# EAGLE design Wind_Sensitive_LED_Tree_v1 (EAGLE 9.7.0)

## Sheet 1 of 3
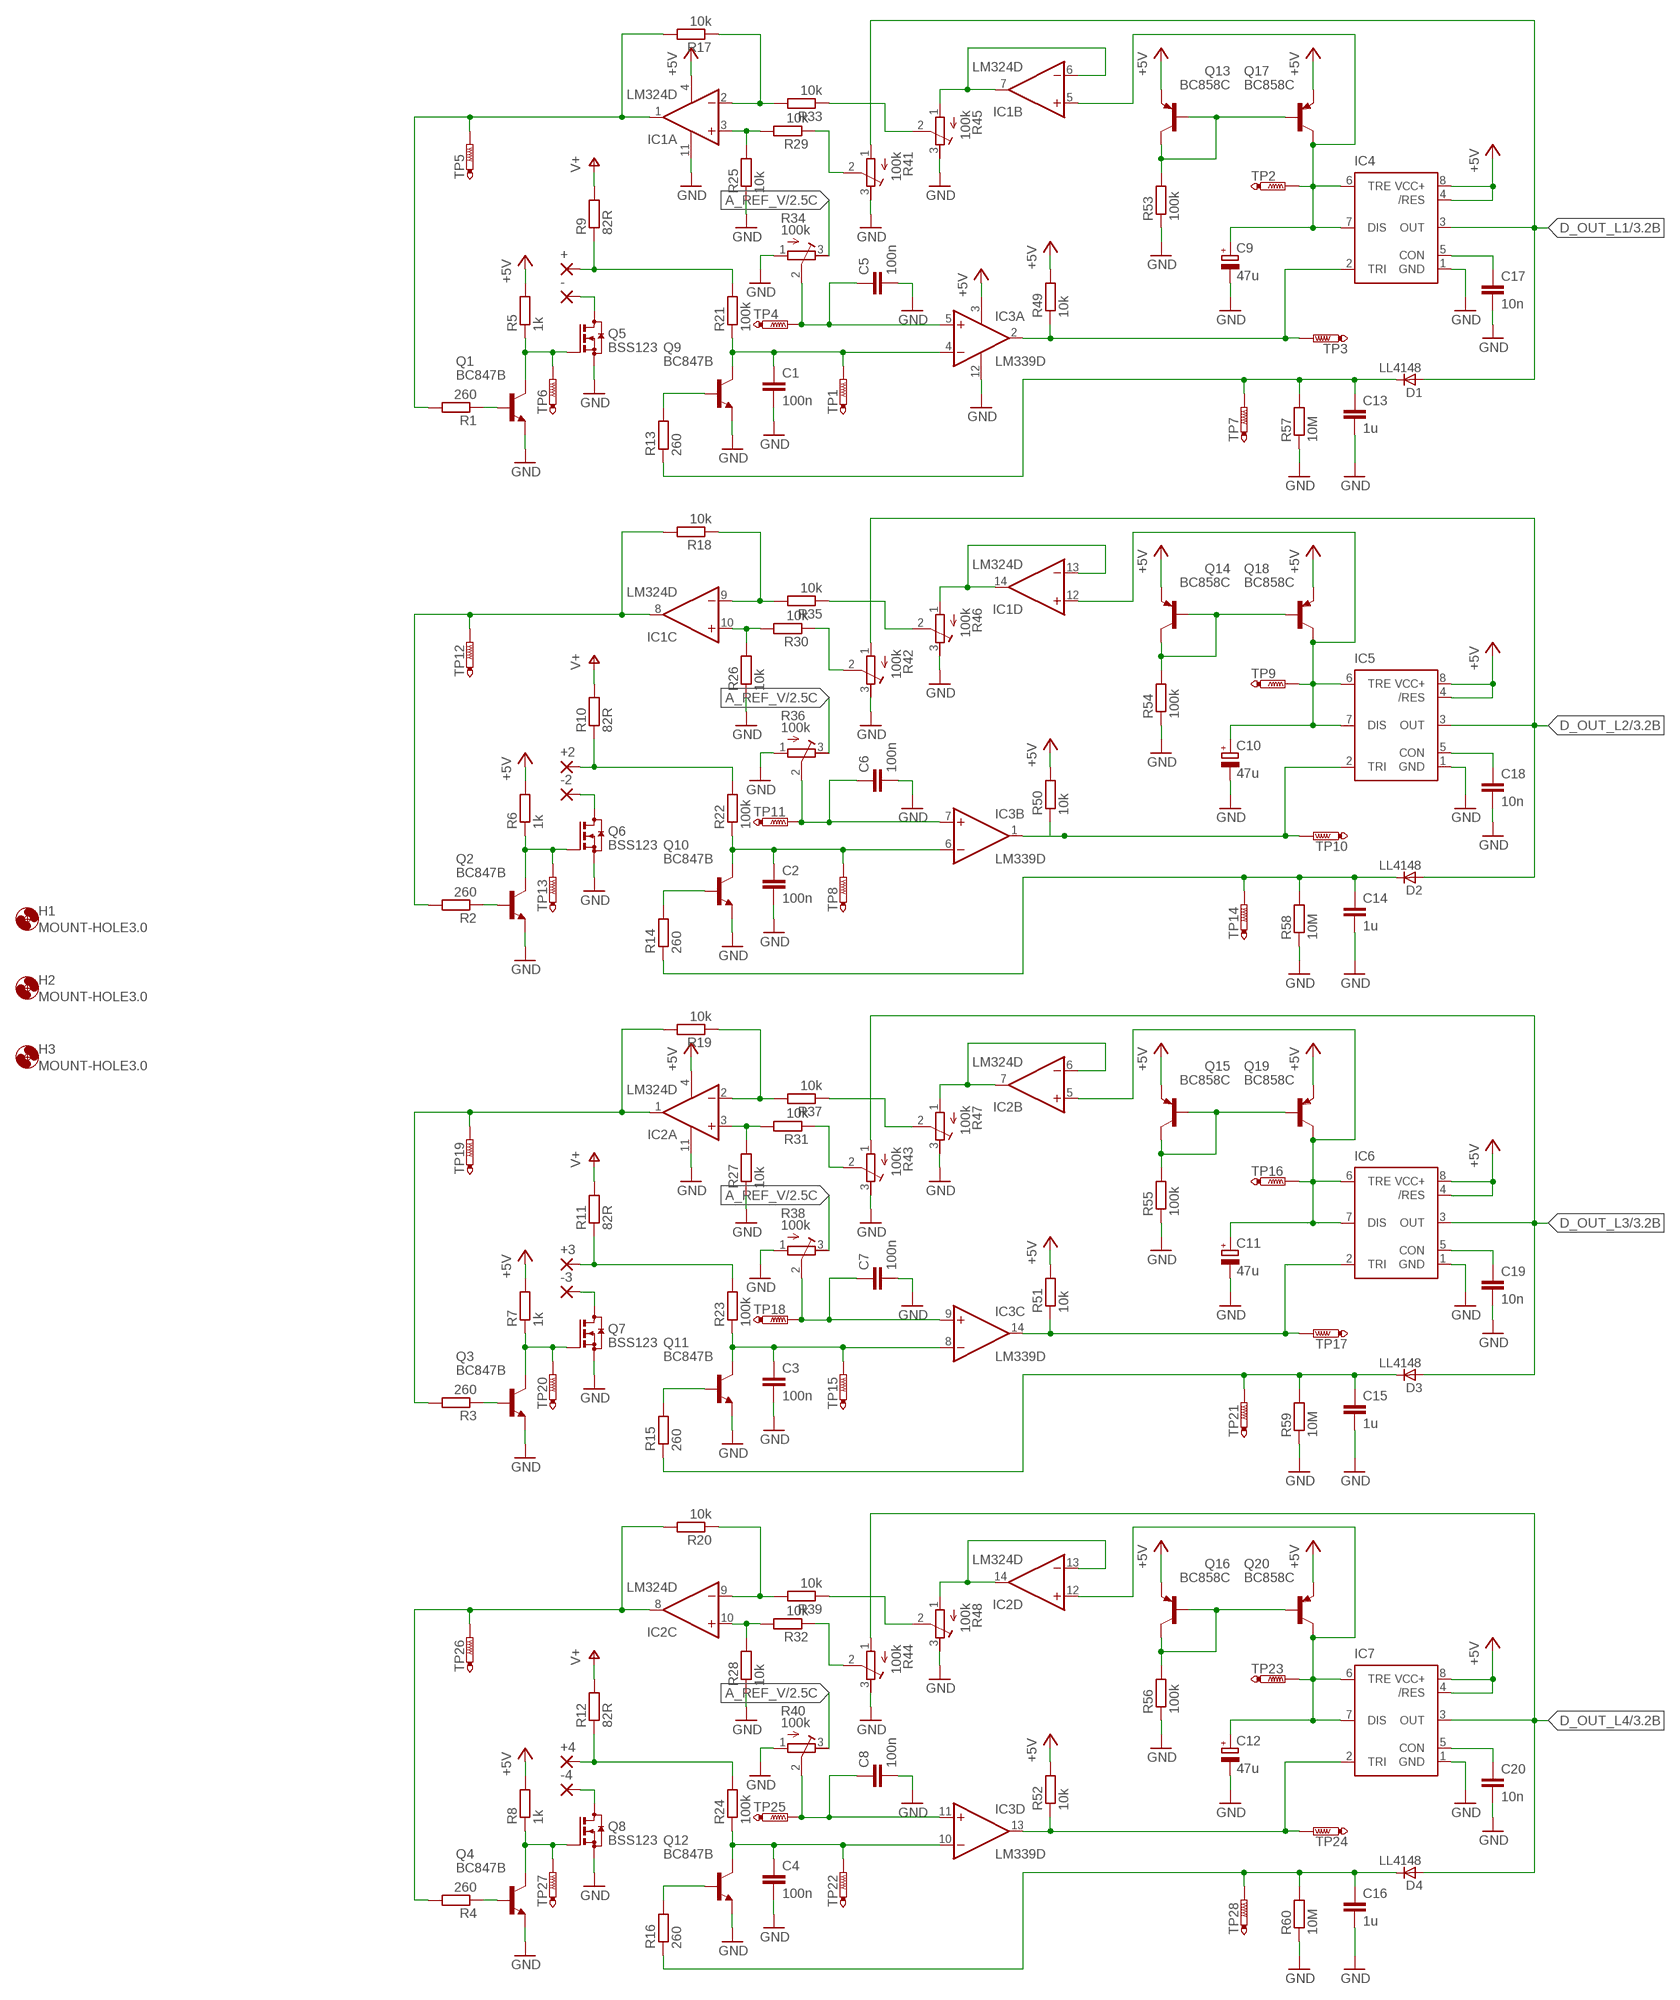
[diagram p0: schematic, sheet 1]

### Parts
+  SMD2  [SMD1,27-2,54]
+2  SMD2  [SMD1,27-2,54]
+3  SMD2  [SMD1,27-2,54]
+4  SMD2  [SMD1,27-2,54]
-  SMD2  [SMD1,27-2,54]
-2  SMD2  [SMD1,27-2,54]
-3  SMD2  [SMD1,27-2,54]
-4  SMD2  [SMD1,27-2,54]
C1  100n  C-EUC1206  [C1206]
C2  100n  C-EUC1206  [C1206]
C3  100n  C-EUC1206  [C1206]
C4  100n  C-EUC1206  [C1206]
C5  100n  C-EUC1206  [C1206]
C6  100n  C-EUC1206  [C1206]
C7  100n  C-EUC1206  [C1206]
C8  100n  C-EUC1206  [C1206]
C9  47u  CPOL-EU153CLV-0605  [153CLV-0605]
C10  47u  CPOL-EU153CLV-0605  [153CLV-0605]
C11  47u  CPOL-EU153CLV-0605  [153CLV-0605]
C12  47u  CPOL-EU153CLV-0605  [153CLV-0605]
C13  1u  C-EUC0805  [C0805]
C14  1u  C-EUC0805  [C0805]
C15  1u  C-EUC0805  [C0805]
C16  1u  C-EUC0805  [C0805]
C17  10n  C-EUC0805  [C0805]
C18  10n  C-EUC0805  [C0805]
C19  10n  C-EUC0805  [C0805]
C20  10n  C-EUC0805  [C0805]
D1  LL4148  [SOD80_DO213AA_MINIMELF]
D2  LL4148  [SOD80_DO213AA_MINIMELF]
D3  LL4148  [SOD80_DO213AA_MINIMELF]
D4  LL4148  [SOD80_DO213AA_MINIMELF]
H1  MOUNT-HOLE3.0  [3,0]
H2  MOUNT-HOLE3.0  [3,0]
H3  MOUNT-HOLE3.0  [3,0]
IC1  LM324D  [SO14]
IC2  LM324D  [SO14]
IC3  LM339D  [SO14]
IC4  SPARKFUN-IC-SPECIAL-FUNCTION_555NE555_TSOP8  [TSSOP8]
IC5  SPARKFUN-IC-SPECIAL-FUNCTION_555NE555_TSOP8  [TSSOP8]
IC6  SPARKFUN-IC-SPECIAL-FUNCTION_555NE555_TSOP8  [TSSOP8]
IC7  SPARKFUN-IC-SPECIAL-FUNCTION_555NE555_TSOP8  [TSSOP8]
Q1  BC847B  BC847BSMD  [SOT23]
Q2  BC847B  BC847BSMD  [SOT23]
Q3  BC847B  BC847BSMD  [SOT23]
Q4  BC847B  BC847BSMD  [SOT23]
Q5  BSS123  [SOT23]
Q6  BSS123  [SOT23]
Q7  BSS123  [SOT23]
Q8  BSS123  [SOT23]
Q9  BC847B  BC847BSMD  [SOT23]
Q10  BC847B  BC847BSMD  [SOT23]
Q11  BC847B  BC847BSMD  [SOT23]
Q12  BC847B  BC847BSMD  [SOT23]
Q13  BC858C  BC858CLT1SMD  [SOT23-BEC]
Q14  BC858C  BC858CLT1SMD  [SOT23-BEC]
Q15  BC858C  BC858CLT1SMD  [SOT23-BEC]
Q16  BC858C  BC858CLT1SMD  [SOT23-BEC]
Q17  BC858C  BC858CLT1SMD  [SOT23-BEC]
Q18  BC858C  BC858CLT1SMD  [SOT23-BEC]
Q19  BC858C  BC858CLT1SMD  [SOT23-BEC]
Q20  BC858C  BC858CLT1SMD  [SOT23-BEC]
R1  260  R-EU_R0603  [R0603]
R2  260  R-EU_R0603  [R0603]
R3  260  R-EU_R0603  [R0603]
R4  260  R-EU_R0603  [R0603]
R5  1k  R-EU_R0603  [R0603]
R6  1k  R-EU_R0603  [R0603]
R7  1k  R-EU_R0603  [R0603]
R8  1k  R-EU_R0603  [R0603]
R9  82R  R-EU_R0603  [R0603]
R10  82R  R-EU_R0603  [R0603]
R11  82R  R-EU_R0603  [R0603]
R12  82R  R-EU_R0603  [R0603]
R13  260  R-EU_R0603  [R0603]
R14  260  R-EU_R0603  [R0603]
R15  260  R-EU_R0603  [R0603]
R16  260  R-EU_R0603  [R0603]
R17  10k  R-EU_R0603  [R0603]
R18  10k  R-EU_R0603  [R0603]
R19  10k  R-EU_R0603  [R0603]
R20  10k  R-EU_R0603  [R0603]
R21  100k  R-EU_R0603  [R0603]
R22  100k  R-EU_R0603  [R0603]
R23  100k  R-EU_R0603  [R0603]
R24  100k  R-EU_R0603  [R0603]
R25  10k  R-EU_R0603  [R0603]
R26  10k  R-EU_R0603  [R0603]
R27  10k  R-EU_R0603  [R0603]
R28  10k  R-EU_R0603  [R0603]
R29  10k  R-EU_R0603  [R0603]
R30  10k  R-EU_R0603  [R0603]
R31  10k  R-EU_R0603  [R0603]
R32  10k  R-EU_R0603  [R0603]
R33  10k  R-EU_R0603  [R0603]
R34  100k  R-TRIMMCVR42A  [RTRIMCVR42A]
R35  10k  R-EU_R0603  [R0603]
R36  100k  R-TRIMMCVR42A  [RTRIMCVR42A]
R37  10k  R-EU_R0603  [R0603]
R38  100k  R-TRIMMCVR42A  [RTRIMCVR42A]
R39  10k  R-EU_R0603  [R0603]
R40  100k  R-TRIMMCVR42A  [RTRIMCVR42A]
R41  100k  R-TRIMMCVR42A  [RTRIMCVR42A]
R42  100k  R-TRIMMCVR42A  [RTRIMCVR42A]
R43  100k  R-TRIMMCVR42A  [RTRIMCVR42A]
R44  100k  R-TRIMMCVR42A  [RTRIMCVR42A]
R45  100k  R-TRIMMCVR42A  [RTRIMCVR42A]
R46  100k  R-TRIMMCVR42A  [RTRIMCVR42A]
R47  100k  R-TRIMMCVR42A  [RTRIMCVR42A]
R48  100k  R-TRIMMCVR42A  [RTRIMCVR42A]
R49  10k  R-EU_R0603  [R0603]
R50  10k  R-EU_R0603  [R0603]
R51  10k  R-EU_R0603  [R0603]
R52  10k  R-EU_R0603  [R0603]
R53  100k  R-EU_R0603  [R0603]
R54  100k  R-EU_R0603  [R0603]
R55  100k  R-EU_R0603  [R0603]
R56  100k  R-EU_R0603  [R0603]
R57  10M  R-EU_R0603  [R0603]
R58  10M  R-EU_R0603  [R0603]
R59  10M  R-EU_R0603  [R0603]
R60  10M  R-EU_R0603  [R0603]
TP1  PTR1B1,27  [B1,27]
TP2  PTR1B1,27  [B1,27]
TP3  PTR1B1,27  [B1,27]
TP4  PTR1B1,27  [B1,27]
TP5  PTR1B1,27  [B1,27]
TP6  PTR1B1,27  [B1,27]
TP7  PTR1B1,27  [B1,27]
TP8  PTR1B1,27  [B1,27]
TP9  PTR1B1,27  [B1,27]
TP10  PTR1B1,27  [B1,27]
TP11  PTR1B1,27  [B1,27]
TP12  PTR1B1,27  [B1,27]
TP13  PTR1B1,27  [B1,27]
TP14  PTR1B1,27  [B1,27]
TP15  PTR1B1,27  [B1,27]
TP16  PTR1B1,27  [B1,27]
TP17  PTR1B1,27  [B1,27]
TP18  PTR1B1,27  [B1,27]
TP19  PTR1B1,27  [B1,27]
TP20  PTR1B1,27  [B1,27]
TP21  PTR1B1,27  [B1,27]
TP22  PTR1B1,27  [B1,27]
TP23  PTR1B1,27  [B1,27]
TP24  PTR1B1,27  [B1,27]
TP25  PTR1B1,27  [B1,27]
TP26  PTR1B1,27  [B1,27]
TP27  PTR1B1,27  [B1,27]
TP28  PTR1B1,27  [B1,27]

### Nets
+5V: IC1.4(P:V+) IC2.4(P:V+) IC3.3(P:V+) IC4.4(/RES) IC4.8(VCC+) IC5.4(/RES) IC5.8(VCC+) IC6.4(/RES) IC6.8(VCC+) IC7.4(/RES) IC7.8(VCC+) Q13.E Q14.E Q15.E Q16.E Q17.E Q18.E Q19.E Q20.E R5.2 R6.2 R7.2 R8.2 R49.2 R50.2 R51.2 R52.2 ; also sheet 2,3
A_REF_V: R34.3(E) R36.3(E) R38.3(E) R40.3(E) ; also sheet 2
D_OUT_L1: D1.A IC4.3(OUT) R41.1(A) ; also sheet 3
D_OUT_L2: D2.A IC5.3(OUT) R42.1(A) ; also sheet 3
D_OUT_L3: D3.A IC6.3(OUT) R43.1(A) ; also sheet 3
D_OUT_L4: D4.A IC7.3(OUT) R44.1(A) ; also sheet 3
GND: C1.2 C2.2 C3.2 C4.2 C5.2 C6.2 C7.2 C8.2 C9.- C10.- C11.- C12.- C13.2 C14.2 C15.2 C16.2 C17.2 C18.2 C19.2 C20.2 IC1.11(P:V-) IC2.11(P:V-) IC3.12(P:GND) IC4.1(GND) IC5.1(GND) IC6.1(GND) IC7.1(GND) Q1.2(E) Q2.2(E) Q3.2(E) Q4.2(E) Q5.2(S) Q6.2(S) Q7.2(S) Q8.2(S) Q9.2(E) Q10.2(E) Q11.2(E) Q12.2(E) R25.1 R26.1 R27.1 R28.1 R34.1(A) R36.1(A) R38.1(A) R40.1(A) R41.3(E) R42.3(E) R43.3(E) R44.3(E) R45.3(E) R46.3(E) R47.3(E) R48.3(E) R53.1 R54.1 R55.1 R56.1 R57.1 R58.1 R59.1 R60.1 ; also sheet 2,3
N$1: -.1(P) Q5.3(D)
N$2: +.1(P) R9.1 R21.2
N$3: Q1.3(C) Q5.1(G) R5.1 TP6.TP
N$4: Q1.1(B) R1.1
N$5: IC1.1(A:OUT) R1.2 R17.2 TP5.TP
N$6: IC1.2(A:-IN) R17.1 R33.2
N$7: IC1.3(A:+IN) R25.2 R29.2
N$8: C1.1 IC3.4(A:-IN) Q9.3(C) R21.1 TP1.TP
N$9: Q9.1(B) R13.2
N$11: IC3.2(A:OUT) IC4.2(TRI) R49.1 TP3.TP
N$12: Q13.B Q13.C Q17.B R53.2
N$13: R29.1 R41.2(S)
N$14: R33.1 R45.2(S)
N$16: IC1.6(B:-IN) IC1.7(B:OUT) R45.1(A)
N$17: C9.+ IC1.5(B:+IN) IC4.6(TRE) IC4.7(DIS) Q17.C TP2.TP
N$18: C13.1 D1.C R13.1 R57.2 TP7.TP
N$19: C17.1 IC4.5(CON)
N$20: C5.1 IC3.5(A:+IN) R34.2(S) TP4.TP
N$21: -2.1(P) Q6.3(D)
N$22: +2.1(P) R10.1 R22.2
N$23: Q2.3(C) Q6.1(G) R6.1 TP13.TP
N$24: Q2.1(B) R2.1
N$25: IC1.8(C:OUT) R2.2 R18.2 TP12.TP
N$26: IC1.9(C:-IN) R18.1 R35.2
N$27: IC1.10(C:+IN) R26.2 R30.2
N$28: C2.1 IC3.6(B:-IN) Q10.3(C) R22.1 TP8.TP
N$29: Q10.1(B) R14.2
N$30: IC3.1(B:OUT) IC5.2(TRI) R50.1 TP10.TP
N$31: Q14.B Q14.C Q18.B R54.2
N$32: R30.1 R42.2(S)
N$33: R35.1 R46.2(S)
N$35: IC1.13(D:-IN) IC1.14(D:OUT) R46.1(A)
N$36: C10.+ IC1.12(D:+IN) IC5.6(TRE) IC5.7(DIS) Q18.C TP9.TP
N$37: C18.1 IC5.5(CON)
N$38: C14.1 D2.C R14.1 R58.2 TP14.TP
N$39: C6.1 IC3.7(B:+IN) R36.2(S) TP11.TP
N$40: -3.1(P) Q7.3(D)
N$41: +3.1(P) R11.1 R23.2
N$42: Q3.3(C) Q7.1(G) R7.1 TP20.TP
N$43: Q3.1(B) R3.1
N$44: IC2.1(A:OUT) R3.2 R19.2 TP19.TP
N$45: IC2.2(A:-IN) R19.1 R37.2
N$46: IC2.3(A:+IN) R27.2 R31.2
N$47: C3.1 IC3.8(C:-IN) Q11.3(C) R23.1 TP15.TP
N$48: Q11.1(B) R15.2
N$49: IC3.14(C:OUT) IC6.2(TRI) R51.1 TP17.TP
N$50: Q15.B Q15.C Q19.B R55.2
N$51: R31.1 R43.2(S)
N$52: R37.1 R47.2(S)
N$54: IC2.6(B:-IN) IC2.7(B:OUT) R47.1(A)
N$55: C11.+ IC2.5(B:+IN) IC6.6(TRE) IC6.7(DIS) Q19.C TP16.TP
N$56: C19.1 IC6.5(CON)
N$57: C15.1 D3.C R15.1 R59.2 TP21.TP
N$58: C7.1 IC3.9(C:+IN) R38.2(S) TP18.TP
N$59: -4.1(P) Q8.3(D)
N$60: +4.1(P) R12.1 R24.2
N$61: Q4.3(C) Q8.1(G) R8.1 TP27.TP
N$62: Q4.1(B) R4.1
N$63: IC2.8(C:OUT) R4.2 R20.2 TP26.TP
N$64: IC2.9(C:-IN) R20.1 R39.2
N$65: IC2.10(C:+IN) R28.2 R32.2
N$66: C4.1 IC3.10(D:-IN) Q12.3(C) R24.1 TP22.TP
N$67: Q12.1(B) R16.2
N$68: IC3.13(D:OUT) IC7.2(TRI) R52.1 TP24.TP
N$69: Q16.B Q16.C Q20.B R56.2
N$70: R32.1 R44.2(S)
N$71: R39.1 R48.2(S)
N$73: IC2.13(D:-IN) IC2.14(D:OUT) R48.1(A)
N$74: C12.+ IC2.12(D:+IN) IC7.6(TRE) IC7.7(DIS) Q20.C TP23.TP
N$75: C20.1 IC7.5(CON)
N$76: C16.1 D4.C R16.1 R60.2 TP28.TP
N$77: C8.1 IC3.11(D:+IN) R40.2(S) TP25.TP
V+: R9.2 R10.2 R11.2 R12.2 ; also sheet 2

## Sheet 2 of 3
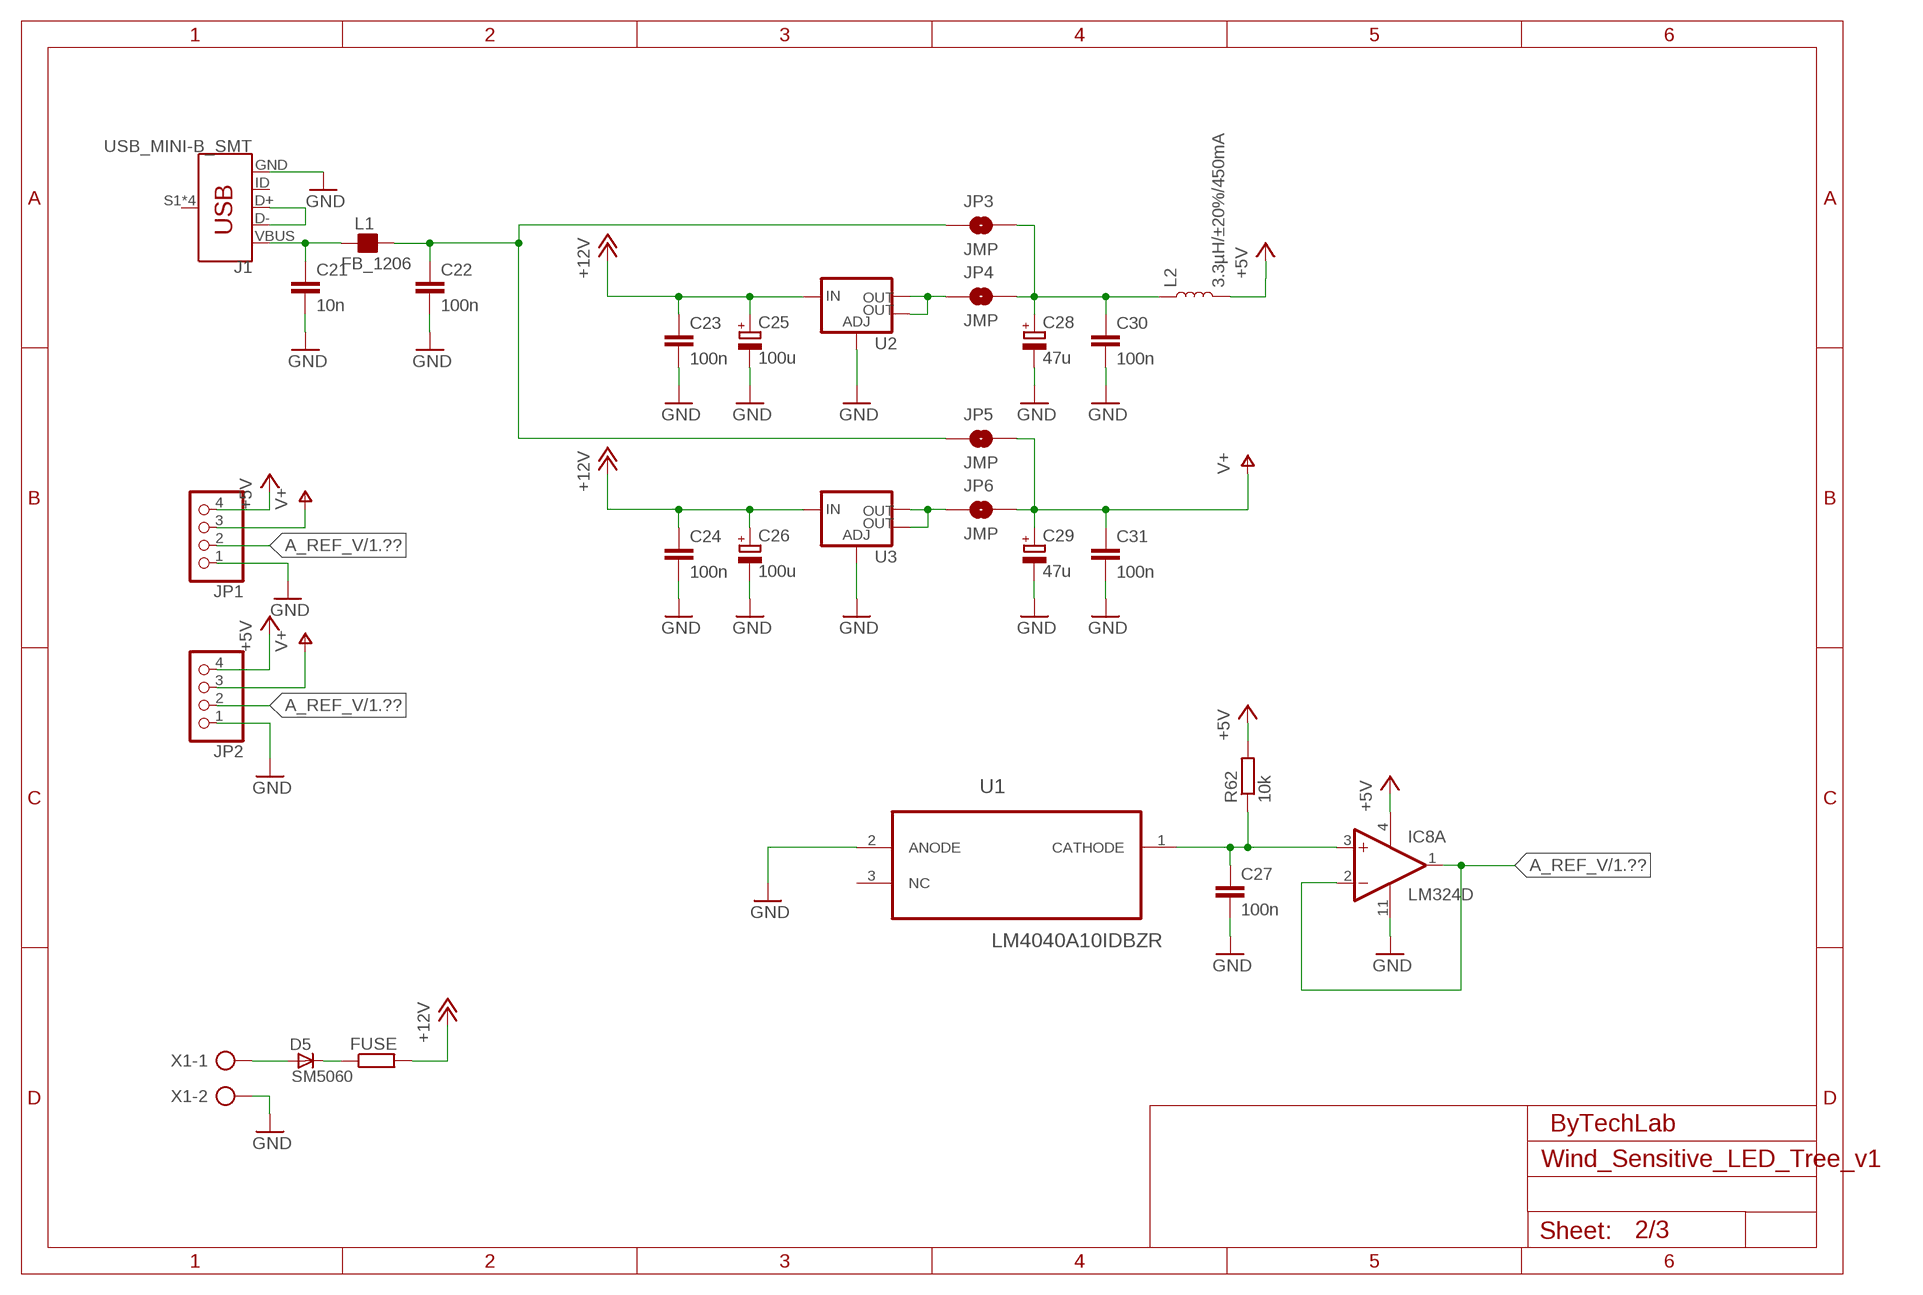
[diagram p1: schematic, sheet 2]

### Parts
C21  10n  C-EUC0805  [C0805]
C22  100n  C-EUC1206  [C1206]
C23  100n  C-EUC1206  [C1206]
C24  100n  C-EUC1206  [C1206]
C25  100u  CPOL-EU153CLV-0810  [153CLV-0810]
C26  100u  CPOL-EU153CLV-0810  [153CLV-0810]
C27  100n  C-EUC1206  [C1206]
C28  47u  CPOL-EU153CLV-0605  [153CLV-0605]
C29  47u  CPOL-EU153CLV-0605  [153CLV-0605]
C30  100n  C-EUC1206  [C1206]
C31  100n  C-EUC1206  [C1206]
D5  SM5060  SM4001  [MELF-MLL41_DO213AB]
FUSE  R-EU_R1206  [R1206]
IC8  LM324D  [SO14]
J1  USB_MINI-B_SMT  [USB-MINIB]
JP1  PINHD-1X4  [1X04]
JP2  PINHD-1X4  [1X04]
JP3  JMP  JUMPER-SMT_2_NO_NO-SILK_ROUND  [SMT-JUMPER_2_NO_NO-SILK_ROUND]
JP4  JMP  JUMPER-SMT_2_NO_NO-SILK_ROUND  [SMT-JUMPER_2_NO_NO-SILK_ROUND]
JP5  JMP  JUMPER-SMT_2_NO_NO-SILK_ROUND  [SMT-JUMPER_2_NO_NO-SILK_ROUND]
JP6  JMP  JUMPER-SMT_2_NO_NO-SILK_ROUND  [SMT-JUMPER_2_NO_NO-SILK_ROUND]
L1  FB_1206  [L1206]
L2  3.3µH/±20%/450mA  INDUCTOR-0805-3.3UH  [0805]
R62  10k  R-EU_R0603  [R0603]
U1  LM4040A10IDBZR  [SOT95P237X112-3N]
U2  V_REG_LM1117SOT223  [SOT223]
U3  V_REG_LM1117SOT223  [SOT223]
X1  AK300/2  [AK300/2]

### Nets
+5V: IC8.4(P:V+) JP1.4 JP2.4 L2.2 R62.2 ; also sheet 1,3
+12V: C23.1 C24.1 C25.+ C26.+ FUSE.2 U2.3(IN) U3.3(IN) ; also sheet 3
A_REF_V: IC8.1(A:OUT) IC8.2(A:-IN) JP1.2 JP2.2 ; also sheet 1
GND: C21.2 C22.2 C23.2 C24.2 C25.- C26.- C27.2 C28.- C29.- C30.2 C31.2 IC8.11(P:V-) J1.GND JP1.1 JP2.1 U1.2(ANODE) U2.1(ADJ) U3.1(ADJ) X1.2 ; also sheet 1,3
N$10: C21.1 J1.VBUS L1.1
N$78: C27.1 IC8.3(A:+IN) R62.1 U1.1(CATHODE)
N$79: C28.+ C30.1 JP3.2 JP4.2 L2.1
N$80: C22.1 JP3.1 JP5.1 L1.2
N$81: J1.D+ J1.D-
N$82: JP4.1 U2.2(OUT) U2.4(OUT)
N$83: JP6.1 U3.2(OUT) U3.4(OUT)
N$84: D5.A X1.1
N$85: D5.C FUSE.1
V+: C29.+ C31.1 JP1.3 JP2.3 JP5.2 JP6.2 ; also sheet 1
Unconnected: IC8.5(B:+IN) IC8.6(B:-IN) IC8.7(B:OUT) IC8.8(C:OUT) IC8.9(C:-IN) IC8.10(C:+IN) IC8.12(D:+IN) IC8.13(D:-IN) IC8.14(D:OUT) J1.ID J1.S1(SHIELD) J1.S2(SHIELD) J1.S3(SHIELD) J1.S4(SHIELD) U1.3(NC)

### Notes on the sheet
- ByTechLab

## Sheet 3 of 3
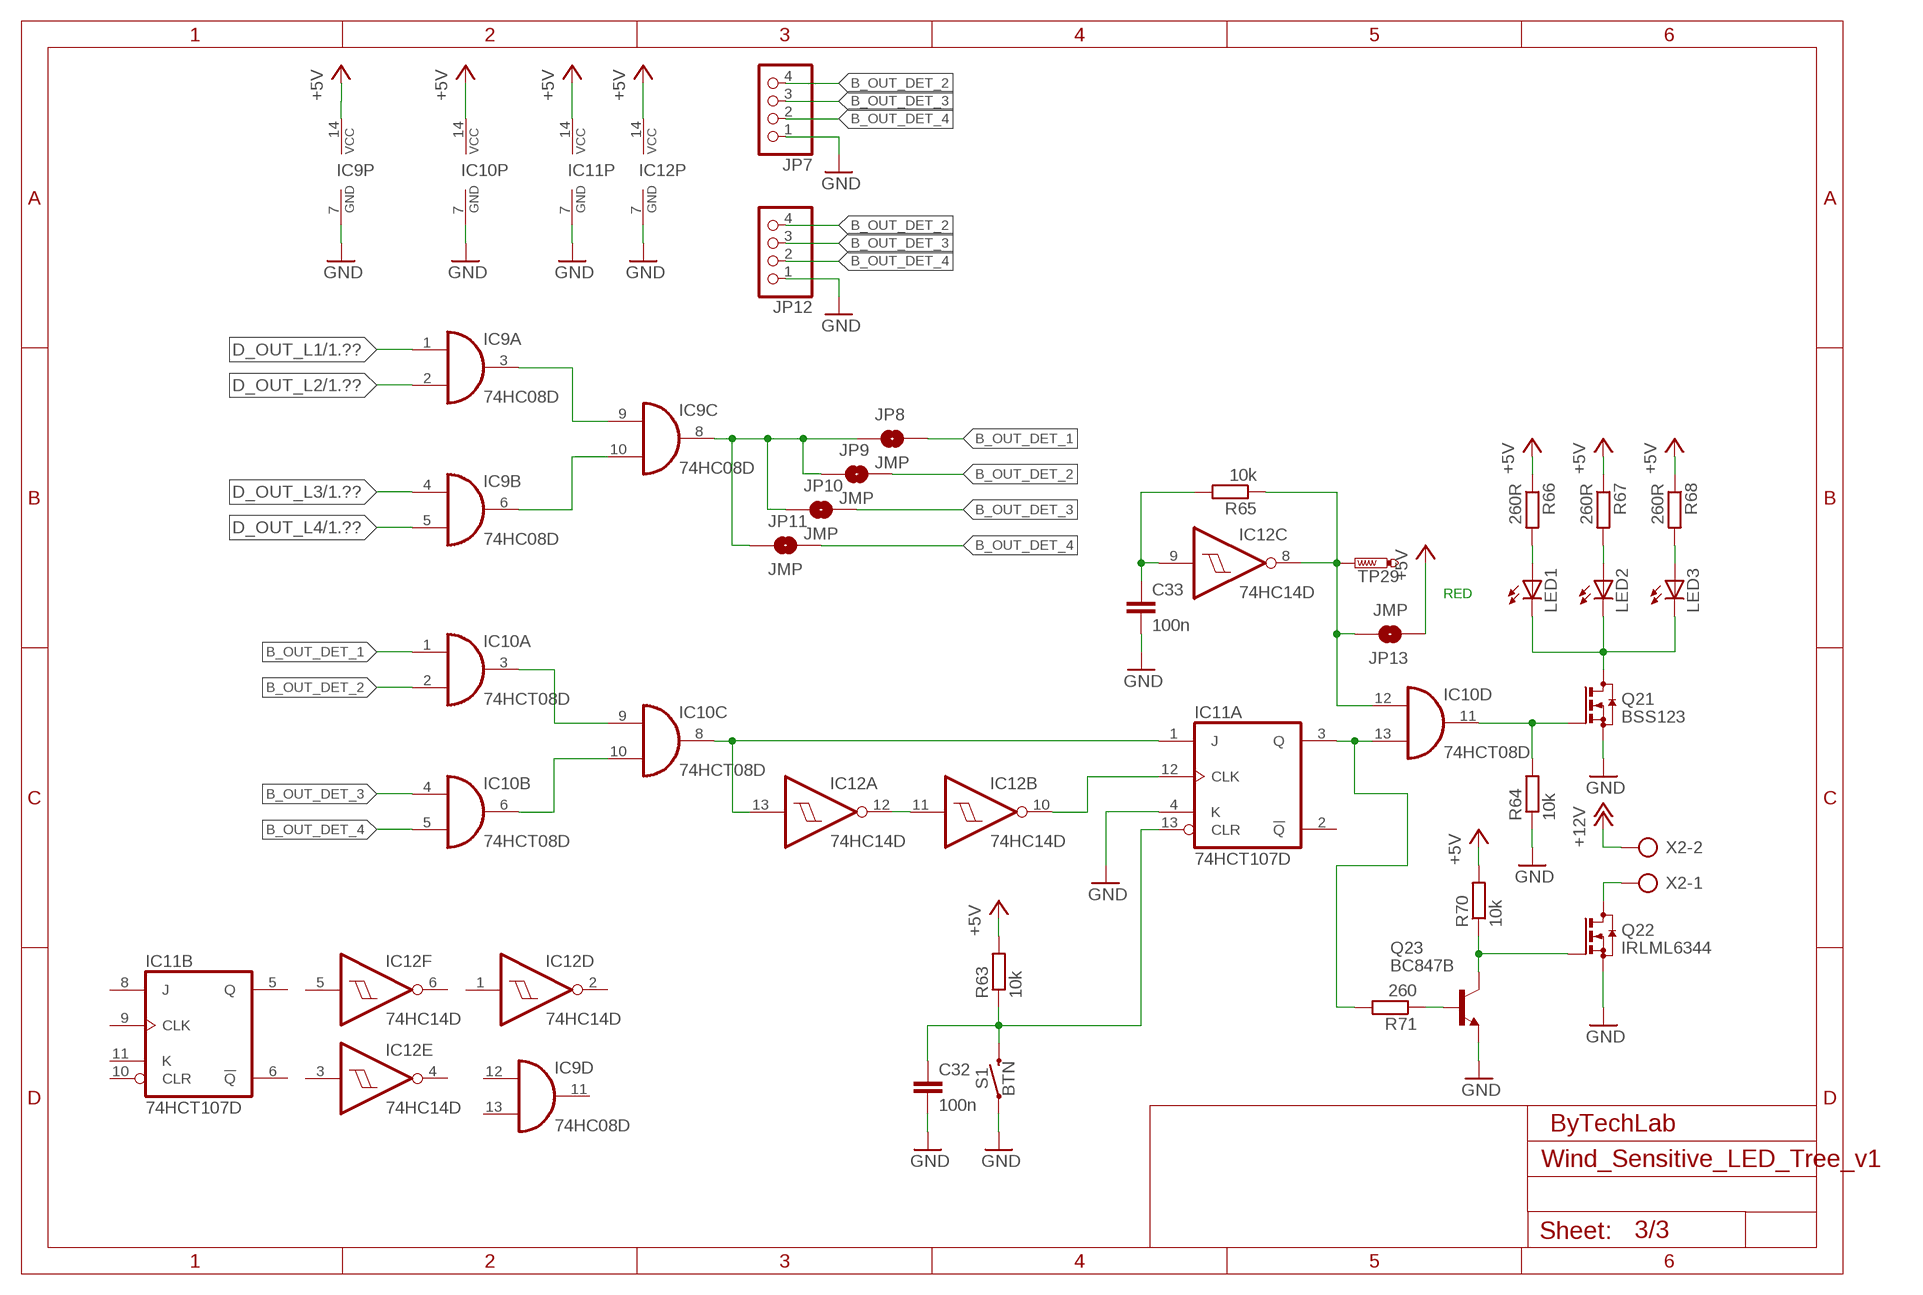
[diagram p2: schematic, sheet 3]

### Parts
C32  100n  C-EUC1206  [C1206]
C33  100n  C-EUC1206  [C1206]
IC9  74HC08D  [SO14]
IC10  74HCT08D  [SO14]
IC11  74HCT107D  [SO14]
IC12  74HC14D  [SO14]
JP7  PINHD-1X4  [1X04]
JP8  JMP  JUMPER-SMT_2_NO_SILK  [SMT-JUMPER_2_NO_SILK]
JP9  JMP  JUMPER-SMT_2_NO_SILK  [SMT-JUMPER_2_NO_SILK]
JP10  JMP  JUMPER-SMT_2_NO_SILK  [SMT-JUMPER_2_NO_SILK]
JP11  JMP  JUMPER-SMT_2_NO_SILK  [SMT-JUMPER_2_NO_SILK]
JP12  PINHD-1X4  [1X04]
JP13  JMP  JUMPER-SMT_2_NO_SILK  [SMT-JUMPER_2_NO_SILK]
LED1  LEDCHIPLED_0805  [CHIPLED_0805]
LED2  LEDCHIPLED_0805  [CHIPLED_0805]
LED3  LEDCHIPLED_0805  [CHIPLED_0805]
Q21  BSS123  [SOT23]
Q22  IRLML6344  BSS123  [SOT23]
Q23  BC847B  BC847BSMD  [SOT23]
R63  10k  R-EU_R0603  [R0603]
R64  10k  R-EU_R0603  [R0603]
R65  10k  R-EU_R0603  [R0603]
R66  260R  R-EU_R0603  [R0603]
R67  260R  R-EU_R0603  [R0603]
R68  260R  R-EU_R0603  [R0603]
R70  10k  R-EU_R0603  [R0603]
R71  260  R-EU_R0603  [R0603]
S1  BTN  MOMENTARY-SWITCH-SPST-SMD-6.0X3.5MM  [TACTILE_SWITCH_SMD_6.0X3.5MM]
TP29  PTR1B1,27  [B1,27]
X2  AK300/2  [AK300/2]

### Nets
+5V: IC9.14(P:VCC) IC10.14(P:VCC) IC11.14(P:VCC) IC12.14(P:VCC) JP13.1 R63.2 R66.1 R67.1 R68.1 R70.2 ; also sheet 1,2
+12V: X2.2 ; also sheet 2
B_OUT_DET_1: IC10.1(A:I0) JP8.2
B_OUT_DET_2: IC10.2(A:I1) JP7.4 JP9.2 JP12.4
B_OUT_DET_3: IC10.4(B:I0) JP7.3 JP10.2 JP12.3
B_OUT_DET_4: IC10.5(B:I1) JP7.2 JP11.2 JP12.2
D_OUT_L1: IC9.1(A:I0) ; also sheet 1
D_OUT_L2: IC9.2(A:I1) ; also sheet 1
D_OUT_L3: IC9.4(B:I0) ; also sheet 1
D_OUT_L4: IC9.5(B:I1) ; also sheet 1
GND: C32.2 C33.2 IC9.7(P:GND) IC10.7(P:GND) IC11.4(A:K) IC11.7(P:GND) IC12.7(P:GND) JP7.1 JP12.1 Q21.2(S) Q22.2(S) Q23.2(E) R64.1 S1.1 ; also sheet 1,2
N$15: IC9.3(A:O) IC9.9(C:I0)
N$34: IC9.6(B:O) IC9.10(C:I1)
N$53: IC9.8(C:O) JP8.1 JP9.1 JP10.1 JP11.1
N$72: IC10.3(A:O) IC10.9(C:I0)
N$86: IC10.6(B:O) IC10.10(C:I1)
N$87: IC12.11(B:I) IC12.12(A:O)
N$88: IC10.8(C:O) IC11.1(A:J) IC12.13(A:I)
N$89: IC11.12(A:CLK) IC12.10(B:O)
N$90: C32.1 IC11.13(A:CLR) R63.1 S1.2
N$91: IC10.11(D:O) Q21.1(G) R64.2
N$92: Q22.3(D) X2.1
N$93: C33.1 IC12.9(C:I) R65.2
N$94: IC10.12(D:I0) IC12.8(C:O) JP13.2 R65.1 TP29.TP
N$95: LED1.C LED2.C LED3.C Q21.3(D)
N$96: LED1.A R66.2
N$97: LED2.A R67.2
N$98: LED3.A R68.2
N$100: IC10.13(D:I1) IC11.3(A:Q) R71.2
N$101: Q22.1(G) Q23.3(C) R70.1
N$102: Q23.1(B) R71.1
Unconnected: IC9.11(D:O) IC9.12(D:I0) IC9.13(D:I1) IC11.2(A:!Q) IC11.5(B:Q) IC11.6(B:!Q) IC11.8(B:J) IC11.9(B:CLK) IC11.10(B:CLR) IC11.11(B:K) IC12.1(D:I) IC12.2(D:O) IC12.3(E:I) IC12.4(E:O) IC12.5(F:I) IC12.6(F:O)

### Notes on the sheet
- RED
- ByTechLab

## Library data of the parts
+ +2-+4 - -2--4 = wirepad:SMD2: SMD PAD
C1-C8 C13-C24 C27 C30-C33 = rcl:C-EU: CAPACITOR, European symbol; SPICEPREFIX: C
C9-C12 C25 C26 C28 C29 = rcl:CPOL-EU: POLARIZED CAPACITOR, European symbol; SPICEPREFIX: C
D1-D4 = _hhn_diodes_smd:LL4148: 1N4148 General Purpose Rectifie SMD-Version of 1N4148 Case: SOD 80 = DO 213 AA = MINIMELF (Glass) Author: Dipl.-Ing. FH Rainer Bayer HHN Hochschule Heilbronn, rainer.bayer@hs-heilbronn.de Ingenieurbüro ing-rb, mail@ing-rb.de
D5 = _hhn_diodes_smd:SM400*: SM4001 .. SM4007 General Purpose Rectifier, 1 A SMD-Version of 1N4001 .. 1N4007 Case: MELF-MLL41 = DO 213 AB Author: Dipl.-Ing. FH Rainer Bayer HHN Hochschule Heilbronn, rainer.bayer@hs-heilbronn.de Ingenieurbüro ing-rb, mail@ing-rb.de
FUSE R1-R33 R35 R37 R39 R49-R60 R62-R68 R70 R71 = rcl:R-EU_: RESISTOR, European symbol; SPICEPREFIX: R
H1-H3 = holes:MOUNT-HOLE: MOUNTING HOLE with drill center marker
IC1 IC2 IC8 = linear:LM324: OP AMP
IC3 = linear3:LM339: Low Power Low Offset Voltage Quad Comparators with open collector; LM139/LM239/LM339/LM2901/LM3302
IC4-IC7 = Blow out LED tree:SPARKFUN-IC-SPECIAL-FUNCTION_555: General purpose bipolar Timer Datasheet <http://www.sparkfun.com/datasheets/Components/General/ne555.pdf> SparkFun Products SparkFun SparkPunk Sequencer Kit <https://www.sparkfun.com/products/12707> (KIT-12707) Storefront Component: 555 Timer <https://www.sparkfun.com/products/9273> (COM-09273) Two parts valid for production: VFP: IC-11930 (M7555 PTH) VFP: IC-09173 (555 PTH) - Preferred
IC9 IC10 = 74xx-eu:74*08: Quad 2-input AND gate
IC11 = 74xx-eu:74*107: Dual J-K FLIP FLOP, clear
IC12 = 74xx-eu:74*14: Hex schmitt trigger INVERTER
J1 = SparkFun-Connectors:USB_MINI-B: USB type Mini-B Connector Breaks out 5th pin, and includes shield pins if needed. SparkFun Products: SparkFun FTDI Basic Breakout <https://www.sparkfun.com/products/9716> SparkFun XBee Explorer USB <https://www.sparkfun.com/products/11812> SparkFun Redboard <https://www.sparkfun.com/products/12757>; PROD_ID: CONN-08193; SF_ID: PRT-00587
JP1 JP2 JP7 JP12 = pinhead:PINHD-1X4: PIN HEADER
JP3-JP6 JP8-JP11 JP13 = SparkFun-Jumpers:JUMPER-SMT_2_NO: Normally open jumper This jumper has two pads in close proximity to each other. Apply solder to close the connection. Round pads are easier to solder for beginners, but are a lot larger. SparkFun Product that uses the round pads: SparkFun EL Sequencer <https://www.sparkfun.com/products/12781>
L1 = rc-master-smd:FB_: FERRITE BEAD
L2 = SparkFun-Coils:INDUCTOR: Inductors Resist changes in electrical current. Basically a coil of wire. SparkFun Products: SparkFun Load Cell Amplifier - HX711 <https://www.sparkfun.com/products/13879> IOIO-OTG - V2.2 <https://www.sparkfun.com/products/13613>; PROD_ID: NDUC-13076
LED1-LED3 = led:LED: LED OSRAM: - CHIPLED LG R971, LG N971, LY N971, LG Q971, LY Q971, LO R971, LY R971 LH N974, LH R974 LS Q976, LO Q976, LY Q976 LO Q996 - Hyper CHIPLED LW Q18S LB Q993, LB Q99A, LB R99A - SideLED LS A670, LO A670, LY A670, LG A670, LP A670 LB A673, LV A673, LT A673, LW A673 LH A674 LY A675 LS A676, LA A676, LO A676, LY A676, LW A676 LS A679, LY A679, LG A679 - Hyper Micro SIDELED® LS Y876, LA Y876, LO Y876, LY Y876 LT Y87S - SmartLED LW L88C, LW L88S LB L89C, LB L89S, LG L890 LS L89K, LO L89K, LY L89K LS L896, LA L896, LO L896, LY L896 - TOPLED LS T670, LO T670, LY T670, LG T670, LP T670 LSG T670, LSP T670, LSY T670, LOP T670, LYG T670 LG T671, LOG T671, LSG T671 LB T673, LV T673, LT T673, LW T673 LH T674 LS T676, LA T676, LO T676, LY T676, LB T676, LH T676, LSB T676, LW T676 LB T67C, LV T67C, LT T67C, LS T67K, LO T67K, LY T67K, LW E67C LS E67B, LA E67B, LO E67B, LY E67B, LB E67C, LV E67C, LT E67C LW T67C LS T679, LY T679, LG T679 LS T770, LO T770, LY T770, LG T770, LP T770 LB T773, LV T773, LT T773, LW T773 LH T774 LS E675, LA E675, LY E675, LS T675 LS T776, LA T776, LO T776, LY T776, LB T776 LHGB T686 LT T68C, LB T68C - Hyper Mini TOPLED® LB M676 - Mini TOPLED Santana® LG M470 LS M47K, LO M47K, LY M47K Source: http://www.osram.convergy.de LUXEON: - LUMILED® LXK2-PW12-R00, LXK2-PW12-S00, LXK2-PW14-U00, LXK2-PW14-V00 LXK2-PM12-R00, LXK2-PM12-S00, LXK2-PM14-U00 LXK2-PE12-Q00, LXK2-PE12-R00, LXK2-PE12-S00, LXK2-PE14-T00, LXK2-PE14-U00 LXK2-PB12-K00, LXK2-PB12-L00, LXK2-PB12-M00, LXK2-PB14-N00, LXK2-PB14-P00, LXK2-PB14-Q00 LXK2-PR12-L00, LXK2-PR12-M00, LXK2-PR14-Q00, LXK2-PR14-R00 LXK2-PD12-Q00, LXK2-PD12-R00, LXK2-PD12-S00 LXK2-PH12-R00, LXK2-PH12-S00 LXK2-PL12-P00, LXK2-PL12-Q00, LXK2-PL12-R00 Source: www.luxeon.com KINGBRIGHT: KA-3528ASYC Source: www.kingbright.com
Q1-Q4 Q9-Q12 Q23 = transistor-npn:BC847*: NPN Transistor
Q5-Q8 Q21 Q22 = transistor-small-signal:BSS123: N-CHANNEL MOS FET
Q13-Q20 = transistor-pnp:BC858*: PNP Transistror
R34 R36 R38 R40-R48 = rcl:R-TRIMM: Trimm resistor; SPICEMODEL: X; SPICEPREFIXL: POT
S1 = SparkFun-Switches:MOMENTARY-SWITCH-SPST: Momentary Switch (Pushbutton) - SPST Normally-open (NO) SPST momentary switches (buttons, pushbuttons). Variants PTH-12MM - 12mm square, through-hole Momentary Pushbutton Switch - 12mm Square <https://www.sparkfun.com/products/9190> (COM-09190) PTH-6.0MM, PTH-6.0MM-KIT - 6.0mm square, through-hole Mini Pushbutton Switch <https://www.sparkfun.com/products/97> (COM-00097) KIT package intended for soldering kit's - only one side of pads' copper is exposed. PTH-RIGHT-ANGLE-KIT - Right-angle, through-hole Right Angle Tactile Button <https://www.sparkfun.com/products/10791> - Used on SparkFun BigTime Watch Kit <https://www.sparkfun.com/products/11734> SMD-12MM - 12mm square, surface-mount Tactile Button - SMD (12mm) <https://www.sparkfun.com/products/12993> (COM-12993) Used on SparkFun PicoBoard <https://www.sparkfun.com/products/11888> SMD-4.5MM - 4.5mm Square Trackball Switch Used on SparkFun Blackberry Trackballer Breakout <https://www.sparkfun.com/products/13169> SMD-4.6MMX2.8MM - 4.60mm x 2.80mm, surface mount Used on SparkFun SAMD21 Mini Breakout <https://www.sparkfun.com/products/13664> SMD-5.2MM, SMD-5.2-REDUNDANT - 5.2mm square, surface-mount Mini Pushbutton Switch - SMD <https://www.sparkfun.com/products/8720> (COM-08720) Used on Arduino Pro Mini <https://www.sparkfun.com/products/11114> REDUNDANT package connects both switch circuits together SMD-6.0X3.5MM - 6.0 x 3.5mm, surface mount Momentary Reset Switch SMD <https://www.sparkfun.com/products/8229> (COM-08229) SMD-6.2MM-TALL - 6.2mm square, surface mount Tactile Button - SMD (6mm) <https://www.sparkfun.com/products/12992> Used on SparkFun Digital Sandbox <https://www.sparkfun.com/products/12651> SMD-RIGHT-ANGLE - Right-angle, surface mount Used on SparkFun Block for Intel® Edison - Arduino <https://www.sparkfun.com/products/13036>; PROD_ID: SWCH-00815; SF_SKU: COM-08229
TP1-TP29 = testpad:PTR1: TEST PIN
U1 = Texas Instruments_By_element14_Batch_1:LM4040A10IDBZR: PRECISION MICROPOWER SHUNT VOLTAGE REFERENCE; MPN: LM4040A10IDBZR; OC_FARNELL: -; OC_NEWARK: 84K2937; PACKAGE: 3-SOT-23; SUPPLIER: TEXAS INSTRUMENTS
U2 U3 = SparkFun-IC-Power:V_REG_LM1117: Voltage Regulator LM1117 Standard adjustable voltage regulator but in SMD form. Spark Fun Electronics SKU : COM-00595; PROD_ID: VREG-08170
X1 X2 = con-ptr500:AK300/2: CONNECTOR; OC_FARNELL: unknown; OC_NEWARK: unknown

## Board
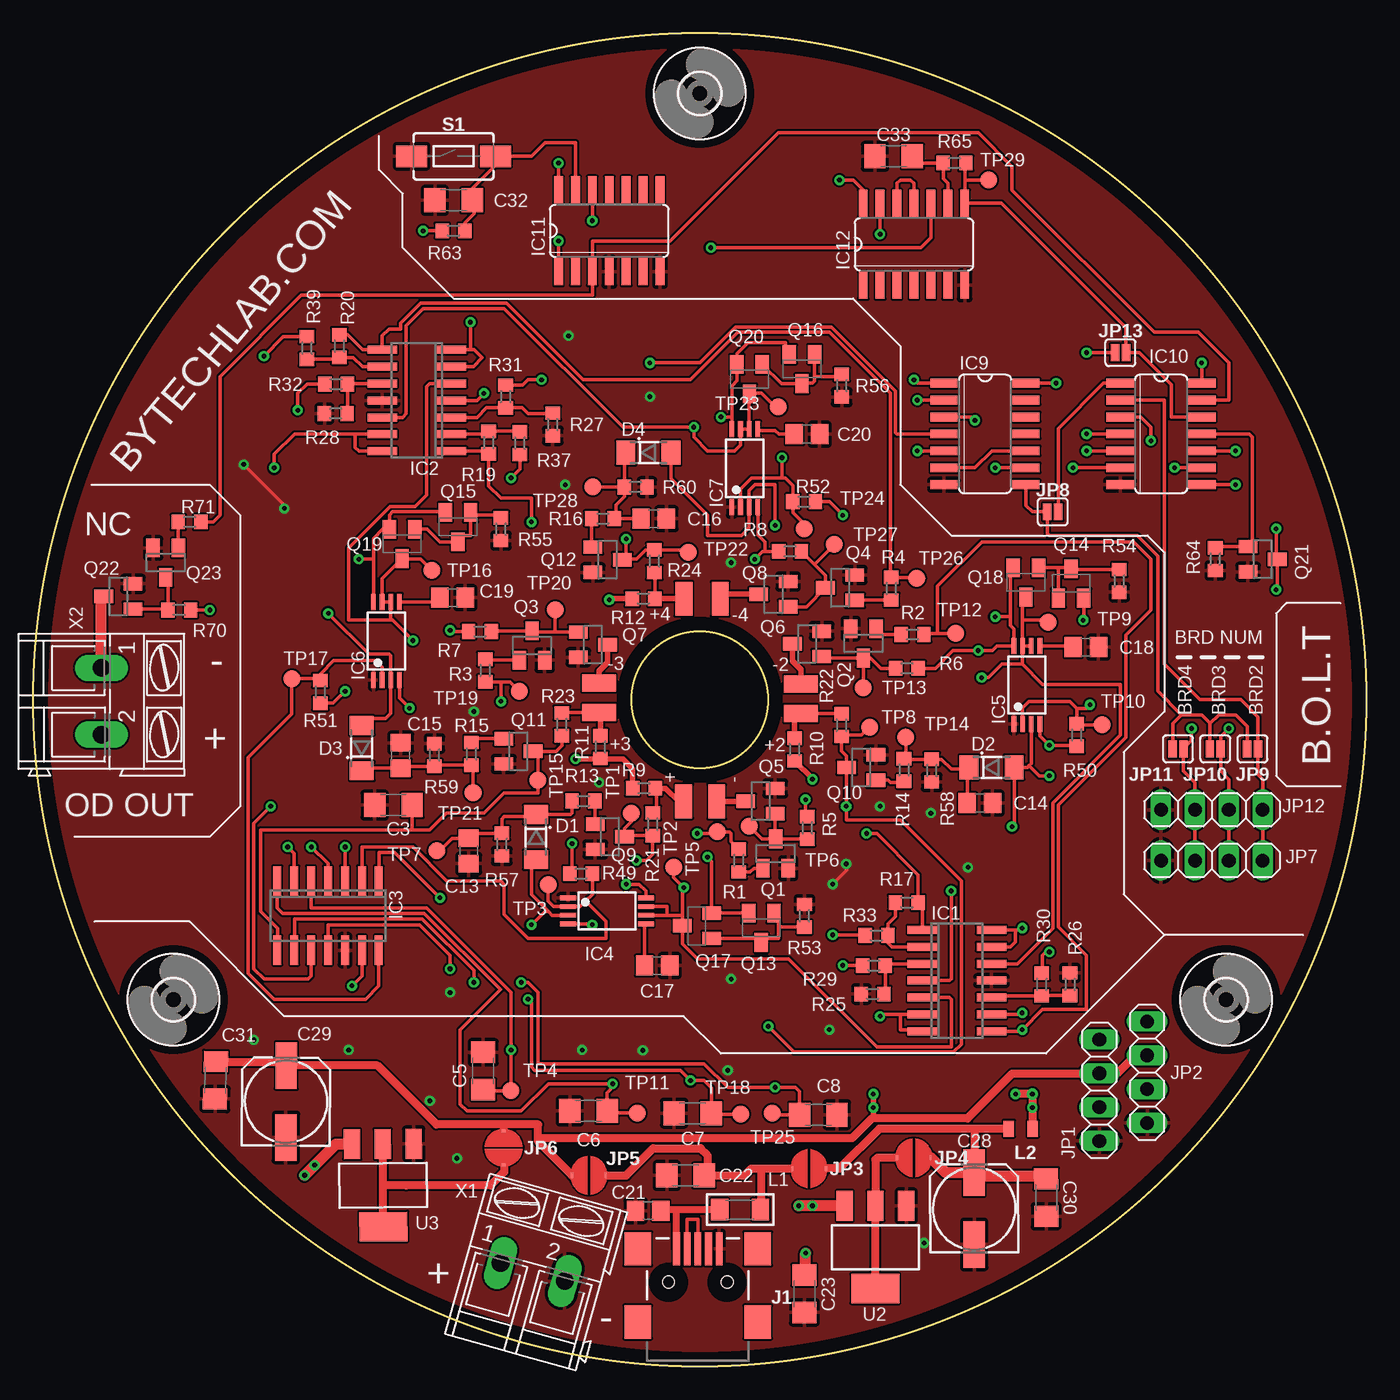
[diagram p3: board, top side]
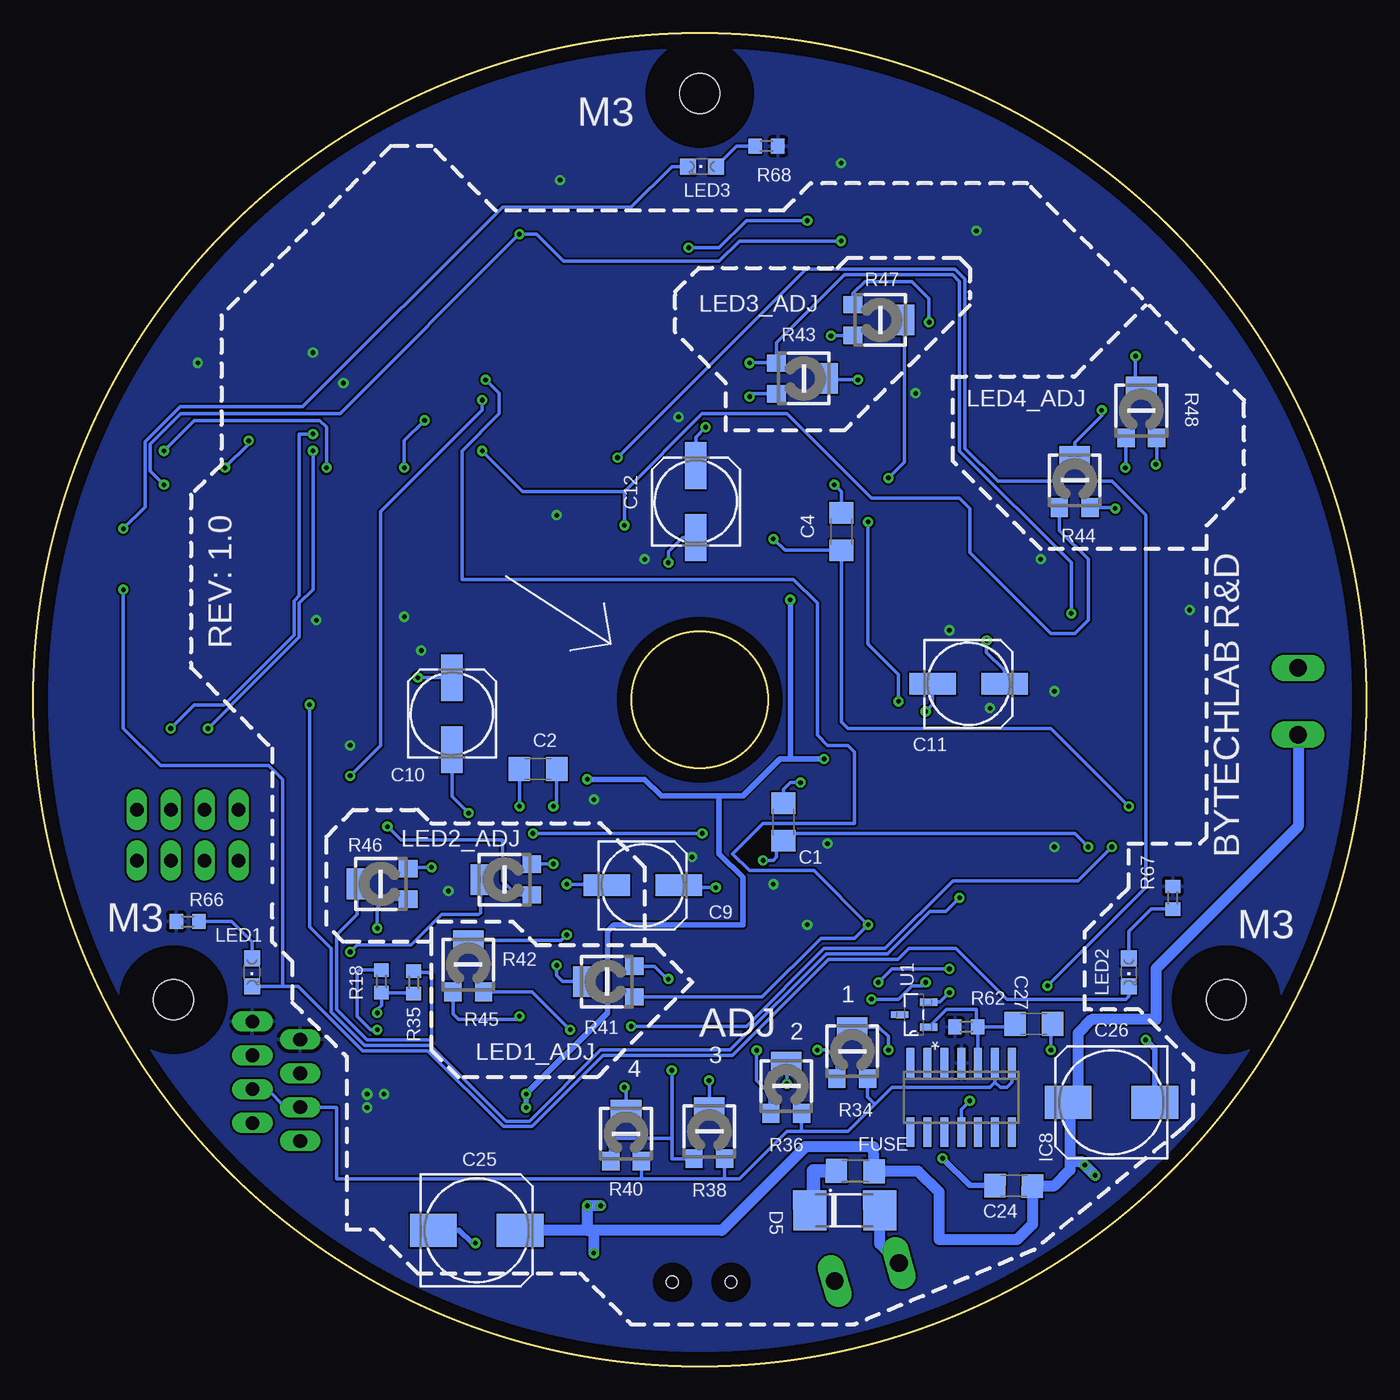
[diagram p4: board, bottom side, seen from below]

Size 100 x 100 mm. Coordinates in mm from the lower left corner, seen from the top.
Outline: circle at 50,50 radius 50
Outline: circle at 50,50 radius 5.1
Copper layers (1*16): Top 0.035mm / dielectric 1.5mm / Bottom 0.035mm
Design rules "Fusion Electronics Design Rules": minimum track width 6mil, minimum drill 0.35mm, track to track 6mil, track to pad 6mil, pad to pad 6mil, via to via 6mil, smd to smd 6mil, copper to edge 40mil, drill to drill 6mil, minimum pad ring 10mil, minimum via ring 8mil, stop-mask expansion 4mil, vias tented up to drill 0mil, thermal gap 10mil

### Footprints (pad centres in the part's own frame; a part is rotated, then mirrored left to right if it is on the bottom)
SMD1,27-2,54 = smd 1.27 x 2.54: 1 0,0
C1206 = smd 1.6 x 1.8: 1 -1.4,0; 2 1.4,0
153CLV-0605 = smd 3.5 x 1.6: + 2.7,0; - -2.7,0
C0805 = smd 1.3 x 1.5: 1 -0.95,0; 2 0.95,0
153CLV-0810 = smd 3.5 x 2.5: + 3.25,0; - -3.25,0
SOD80_DO213AA_MINIMELF = smd 1.4 x 1.8: A 1.7,0; C -1.7,0
MELF-MLL41_DO213AB = smd 2.5 x 3: A 2.625,0; C -2.625,0
R1206 = smd 1.6 x 1.803: 1 -1.422,0; 2 1.422,0
3,0 = hole 3: 0,0
SO14 = smd 0.6 x 2.2: 1 -3.81,-2.6; 2 -2.54,-2.6; 3 -1.27,-2.6; 4 0,-2.6; 5 1.27,-2.6; 6 2.54,-2.6; 7 3.81,-2.6; 8 3.81,2.6; 9 2.54,2.6; 10 1.27,2.6; 11 0,2.6; 12 -1.27,2.6; 13 -2.54,2.6; 14 -3.81,2.6
TSSOP8 = smd 0.35 x 1.2: 1 -0.975,-2.925; 2 -0.325,-2.925; 3 0.325,-2.925; 4 0.975,-2.925; 5 0.975,2.925; 6 0.325,2.925; 7 -0.325,2.925; 8 -0.975,2.925
SO14' = smd 0.66 x 2.032: 1 -3.81,-3.073; 2 -2.54,-3.073; 3 -1.27,-3.073; 4 0,-3.073; 5 1.27,-3.073; 6 2.54,-3.073; 7 3.81,-3.073; 8 3.81,3.073; 9 2.54,3.073; 10 1.27,3.073; 11 0,3.073; 12 -1.27,3.073; 13 -2.54,3.073; 14 -3.81,3.073
USB-MINIB = smd 2.5 x 0.5: D+ 2.5,0; D- 2.5,0.8; GND 2.5,-1.6; ID 2.5,-0.8; VBUS 2.5,1.6 | smd 2.5 x 2: S1 -3,4.5; S2 2.5,4.5; S3 -3,-4.5; S4 2.5,-4.5 | hole 0.9: 0,2.2; 0,-2.2
1X04 = drill 1.016 long: 1 -3.81,0; 2 -1.27,0; 3 1.27,0; 4 3.81,0
SMT-JUMPER_2_NO_NO-SILK_ROUND = smd 0.152 x 0.305: 1 -1.27,0; 2 1.27,0
SMT-JUMPER_2_NO_SILK = smd 0.635 x 1.27: 1 -0.406,0; 2 0.406,0
L1206 = smd 1.3 x 1.6: 1 -1.524,0; 2 1.524,0
0805 = smd 0.8 x 1.2: 1 -0.9,0; 2 0.9,0
CHIPLED_0805 = smd 1.2 x 1.2: A 0,-1.05; C 0,1.05
SOT23 = smd 1 x 1.4: 1 -0.95,-1.1; 2 0.95,-1.1; 3 0,1.1
SOT23-BEC = smd 1 x 1.4: B -0.95,-1.1; C 0,1.1; E 0.95,-1.1
R0603 = smd 1 x 1.1: 1 -0.85,0; 2 0.85,0
RTRIMCVR42A = smd 1.3 x 1.4: 1 -1.15,-2.05; 3 1.15,-2.05 | smd 2.3 x 1.5: 2 0,1.8
TACTILE_SWITCH_SMD_6.0X3.5MM = smd 2.3 x 1.6: 1 -3.15,0; 2 3.15,0
B1,27 = smd 1.27 x 1.27: TP 0,0
SOT95P237X112-3N = smd 1.321 x 0.559: 1 -1.092,0.94; 2 -1.092,-0.94 | smd 1.321 x 0.508: 3 1.092,0
SOT223 = smd 1.219 x 2.235: 1 -2.311,-3.099; 2 0,-3.099; 3 2.311,-3.099 | smd 3.6 x 2.2: 4 0,3.099
AK300/2 = drill 1.321 long: 1 -2.515,0; 2 2.489,0

### Placement (x,y rotation side)
+  48.79,42.37 0 top
+2  57.59,48.96 90 top
+3  42.45,49.03 90 top
+4  48.81,57.58 0 top
-  51.28,42.36 0 top
-2  57.59,51.18 90 top
-3  42.45,51.25 90 top
-4  51.54,57.58 0 top
C1  43.72,40.83 90 bottom
C2  62.13,44.8 180 bottom
C3  27.02,42.1 180 top
C4  39.38,62.61 90 bottom
C5  33.76,22.15 90 top
C6  41.66,19.15 180 top
C7  49.46,18.99 180 top
C8  58.9,18.87 0 top
C9  54.28,36.08 0 bottom
C10  68.6,48.96 90 bottom
C11  29.83,51.2 0 bottom
C12  50.3,64.87 90 bottom
C13  32.67,38.66 270 top
C14  71.02,42.26 0 top
C15  27.56,45.82 90 top
C16  46.55,63.58 0 top
C17  46.8,30.06 0 top
C18  78.97,53.94 0 top
C19  31.46,57.66 0 top
C20  58.05,69.93 0 top
C21  46.13,11.67 180 top
C22  48.93,14.31 180 top
C23  57.86,5.43 270 top
C24  26.44,13.53 179.3 bottom
C25  66.74,10.19 0 bottom
C26  19.11,19.79 180 bottom
C27  24.93,25.67 0 bottom
C28  70.59,11.83 90.1 top
C29  18.96,19.85 89.7 top
C30  75.99,12.65 270.3 top
C31  13.66,21.45 268.7 top
C32  31.53,87.47 180 top
C33  64.55,90.77 180 top
D1  37.7,39.7 270 top
D2  71.89,44.92 0 top
D3  24.64,46.37 90 top
D4  46.15,68.53 0 top
D5  39.11,11.69 0.1 bottom
FUSE  38.33,14.64 359.9 bottom
H1  10.5,27.5 0 top
H2  89.5,27.5 0 top
H3  50,95.5 0 top
IC1  69.29,28.93 270 top
IC2  28.78,72.46 90 top
IC3  22.11,33.81 180 top
IC4  43.04,34.16 270 top
IC5  74.54,51.11 0 top
IC6  26.49,54.41 0 top
IC7  53.38,67.37 0 top
IC8  30.38,20.17 180 bottom
IC9  74HC08D  [SO14']  71.4,69.94 270 top
IC10  74HCT08D  [SO14']  84.61,69.94 270 top
IC11  74HCT107D  [SO14']  43.21,85.18 0 top
IC12  74HC14D  [SO14']  66.07,84.17 0 top
J1  49.85,6.31 90 top
JP1  79.98,20.7 90 top
JP2  83.56,22.05 90 top
JP3  58.2,14.83 0 top
JP4  66.06,15.65 0 top
JP5  41.69,14.32 180 top
JP6  35.28,16.39 90 top
JP7  88.42,37.94 0 top
JP8  76.48,64.1 0 top
JP9  91.47,46.32 0 top
JP10  88.68,46.32 0 top
JP11  85.88,46.32 0 top
JP12  88.42,41.75 0 top
JP13  81.56,76.04 0 top
L1  53.03,11.74 0 top
L2  74.08,17.82 0 top
LED1  83.6,29.56 180 bottom
LED2  17.81,29.56 180 bottom
LED3  49.81,90.01 90 bottom
Q1  55.69,38.46 0 top
Q2  62.28,54.23 180 top
Q3  37.41,54.07 0 top
Q4  60.53,58.4 90 top
Q5  54.56,42.39 90 top
Q6  58.06,54.19 90 top
Q7  41.99,54.13 270 top
Q8  55.53,57.91 90 top
Q9  43.26,39.72 270 top
Q10  62.12,44.92 90 top
Q11  36.4,46.13 270 top
Q12  43.08,60.51 270 top
Q13  54.61,32.89 180 top
Q14  77.86,58.73 0 top
Q15  31.86,62.96 180 top
Q16  57.67,74.82 180 top
Q17  49.79,33.04 90 top
Q18  74.47,58.8 180 top
Q19  27.67,61.69 180 top
Q20  53.73,74.06 180 top
Q21  92.23,60.55 270 top
Q22  6.38,57.75 90 top
Q23  9.94,60.29 180 top
R1  52.93,37.93 90 top
R2  65.97,54.89 0 top
R3  33.91,52.2 270 top
R4  64.37,58.33 90 top
R5  58.07,40.38 90 top
R6  65.54,52.35 0 top
R7  33.51,55.12 180 top
R8  56.78,61.13 180 top
R9  45.82,43.36 180 top
R10  57.12,46.26 270 top
R11  42.54,46.45 270 top
R12  45.78,57.58 180 top
R13  41.27,42.4 0 top
R14  65.32,44.74 270 top
R15  32.87,45.94 90 top
R16  42.73,63.59 180 top
R17  65.53,34.78 0 top
R18  73.88,28.87 90 bottom
R19  34.16,69.29 270 top
R20  22.97,76.53 90 top
R21  46.47,40.66 90 top
R22  60.64,48.09 90 top
R23  39.65,48.15 90 top
R24  46.59,60.39 270 top
R25  62.97,27.92 0 top
R26  77.77,28.65 270 top
R27  38.97,70.66 90 top
R28  22.69,71.47 0 top
R29  63.07,30.06 0 top
R30  75.66,28.63 270 top
R31  35.43,72.76 270 top
R32  22.72,73.68 0 top
R33  63.27,32.31 0 top
R34  38.56,23.63 0 bottom
R35  71.47,28.8 270 bottom
R36  43.51,21.02 0 bottom
R37  36.51,69.24 90 top
R38  49.28,17.62 0 bottom
R39  20.53,76.39 270 top
R40  55.53,17.45 0 bottom
R41  56.97,28.85 90 bottom
R42  64.64,36.51 90 bottom
R43  42.19,74.1 270 bottom
R44  21.87,66.47 0 bottom
R45  67.36,30.13 0 bottom
R46  73.93,36.18 90 bottom
R47  36.46,78.49 270 bottom
R48  16.87,71.7 0 bottom
R49  41.1,36.96 180 top
R50  78.28,47.36 270 top
R51  21.54,50.59 270 top
R52  57.83,64.87 0 top
R53  57.85,33.79 270 top
R54  81.47,58.92 90 top
R55  35.08,62.8 90 top
R56  60.66,73.56 90 top
R57  35.15,39.13 90 top
R58  67.4,44.69 90 top
R59  30.1,45.86 270 top
R60  45.19,65.96 180 top
R62  30.01,25.46 180 bottom
R63  31.53,85.18 180 top
R64  88.68,60.55 90 top
R65  69.12,90.26 180 top
R66  88.42,33.37 0 bottom
R67  14.51,35.15 270 bottom
R68  44.99,91.53 180 bottom
R70  10.95,56.74 0 top
R71  11.71,63.34 0 top
S1  31.53,90.77 0 top
TP1  44.87,41.5 0 top
TP2  48.04,37.43 0 top
TP3  38.62,36.13 0 top
TP4  35.84,20.67 0 top
TP5  51.3,40.09 0 top
TP6  53.7,40.52 0 top
TP7  30.27,38.67 0 top
TP8  62.73,47.95 0 top
TP9  76.12,55.82 0 top
TP10  80.2,48.12 0 top
TP11  45.3,18.99 0 top
TP12  69.19,54.98 0 top
TP13  62.25,50.92 0 top
TP14  65.45,47.19 0 top
TP15  37.85,43.97 0 top
TP16  29.89,59.71 0 top
TP17  19.39,51.59 0 top
TP18  53.07,18.9 0 top
TP19  36.47,50.65 0 top
TP20  39.18,56.75 0 top
TP21  32.99,43.03 0 top
TP22  49.13,61.06 0 top
TP23  55.9,71.99 0 top
TP24  57.84,62.84 0 top
TP25  55.45,18.98 0 top
TP26  66.29,59.11 0 top
TP27  60.1,61.65 0 top
TP28  41.98,65.97 0 top
TP29  71.66,88.99 0 top
U1  33.92,26.38 180 bottom
U2  63.18,8.93 180 top
U3  26.24,13.57 180.4 top
X1  37.48,7.06 344.3 top
X2  5.11,49.88 270 top

### Tracks (layer width: path | path; a pad name or v marks a point on that pad's centre or on a via)
+5V  (via drill 0.35, 0.35 pad 0.85)
  Top 0.254: R5.2 arc90 57.94,41.36 v57.94,42.51 | v40.42,39.21 40.42,37.13 R49.2 | Q13.E Q17.E 50.89,37.88 v50.58,38.19 | v44.48,36.16 45.44,36.16 45.96,35.64 IC4.8 | IC1.4 68.74,28.93 68.86,29.05 v68.86,35.65 | IC3.3 23.4,36.43 v23.4,38.96 | IC4.4 41.94,33.18 v41.94,33.11 | Q14.E 78.81,56.02 v78.77,55.97 | IC5.4 75.52,47.29 v76.23,46.58 78.21,46.58 R50.2 | R6.2 67.66,52.35 69,53.69 v70.9,53.69 71.95,53.69 72.3,54.03 IC5.8 73.57,55.3 73.31,55.56 73.31,56.23 | R8.2 54.89,61.13 | 54.89,61.13 54.72,61.13 v54.13,60.55 | IC7.4 54.35,62.36 54.89,61.82 54.89,61.13 | IC7.8 52.4,71.21 | 52.4,71.21 52.4,73.55 52.78,73.93 Q20.E 52.78,75.96 53.62,76.8 56.42,76.8 56.42,76.22 Q16.E | 52.4,71.21 v51.59,71.21 | R7.2 31.37,55.12 v31.27,55.21 | IC6.4 27.47,50.12 v28.22,49.37 | R51.2 22.5,49.74 v23.4,50.64 | 25.52,60.55 25.52,62.1 26.21,62.79 Q19.E 26.72,63.87 26.95,64.1 30.87,64.1 Q15.E | 25.52,60.55 IC6.8 | 25.52,60.55 v24.41,60.55 | IC2.4 33.28,72.46 v33.81,72.99 | v87.66,75.28 87.66,73.78 IC10.14 | IC9.14 v76.74,73.75 | JP13.1 v79.02,76.04 | v60.48,88.99 61.52,88.99 62.26,88.26 IC12.14 | R70.2 v13.24,56.74 | IC11.14 v39.4,90.26 | R63.2 v29.24,85.18 | 73.31,56.23 v72.17,56.23 | 73.31,56.23 73.31,59.7 Q18.E | R52.2 59.72,64.87 v60.74,63.85
  Top 0.61: L2.2 74.96,17.8 v74.96,19.4 v74.96,20.41 v73.69,20.41
  pour Bottom: 46.43,0.13 50,0 53.57,0.13 57.12,0.51 60.63,1.14 64.09,2.03 67.47,3.15 70.77,4.52 73.96,6.12 77.03,7.94 79.96,9.97 82.74,12.21 85.36,14.64 87.79,17.26 90.03,20.04 92.06,22.97 93.88,26.04 95.48,29.23 96.85,32.53 97.97,35.91 98.86,39.37 99.49,42.88 99.87,46.43 100,50 99.87,53.57 99.49,57.12 98.86,60.63 97.97,64.09 96.85,67.47 95.48,70.77 93.88,73.96 92.06,77.03 90.03,79.96 87.79,82.74 85.36,85.36 82.74,87.79 79.96,90.03 77.03,92.06 73.96,93.88 70.77,95.48 67.47,96.85 64.09,97.97 60.63,98.86 57.12,99.49 53.57,99.87 50,100 46.43,99.87 42.88,99.49 39.37,98.86 35.91,97.97 32.53,96.85 29.23,95.48 26.04,93.88 22.97,92.06 20.04,90.03 17.26,87.79 14.64,85.36 12.21,82.74 9.97,79.96 7.94,77.03 6.12,73.96 4.52,70.77 3.15,67.47 2.03,64.09 1.14,60.63 0.51,57.12 0.13,53.57 0,50 0.13,46.43 0.51,42.88 1.14,39.37 2.03,35.91 3.15,32.53 4.52,29.23 6.12,26.04 7.94,22.97 9.97,20.04 12.21,17.26 14.64,14.64 17.26,12.21 20.04,9.97 22.97,7.94 26.04,6.12 29.23,4.52 32.53,3.15 35.91,2.03 39.37,1.14 42.88,0.51
+12V  (via drill 0.35)
  Top 0.813: U3.3 22.69,16.65 v21.11,15.08 v20.35,14.32 | C23.1 arc90 57.94,6.92 v57.94,8.48 | U2.3 v57.44,12.03 v57.43,12.03
  Bottom 0.813: X2.2 5.11,40.48 15.78,29.81 15.78,26 20.6,26 21.62,24.99 21.62,19.65 22.22,19.65 | 22.22,19.65 C26.+ | 22.22,19.65 22.22,15.33 | 22.22,15.33 22.22,14.73 23.44,13.51 C24.1 25.04,10.64 26.19,9.49 32.03,9.49 32.03,13.05 33.62,14.64 FUSE.2 36.95,16.46 42.07,16.46 48.34,10.19 57.94,10.19 | v20.35,14.32 v21.11,15.08 21.37,15.33 22.22,15.33 | 57.94,10.19 58.45,10.19 | 58.45,10.19 C25.+ | v57.94,8.48 57.94,10.19 | v57.43,12.03 v58.45,12.03 58.45,10.19
A_REF_V
  Bottom 0.203: 27.84,21.3 | 77.25,19.4 77.28,19.43
  Bottom 0.254: IC8.1 26.57,21.3 26.95,20.92 27.46,20.92 27.84,21.3 28.22,20.92 35.59,20.92 36.86,19.65 | 27.84,21.3 IC8.2 | 36.86,19.65 38.89,17.62 42.45,17.62 | 42.45,17.62 43.46,17.62 47.02,14.06 48.04,14.06 | 48.04,14.06 54.39,14.06 | 54.39,14.06 77.25,14.06 77.25,19.4 | 77.28,19.43 JP1.2 81.09,19.43 82.44,20.78 JP2.2 | R34.3 37.41,20.2 36.86,19.65 | R36.3 42.36,17.71 42.45,17.62 | R38.3 48.13,14.16 48.04,14.06 | R40.3 54.39,14.06
B_OUT_DET_1
  Top 0.254: JP8.2 76.89,70.35 80.29,73.75 IC10.1
B_OUT_DET_2
  Top 0.254: JP7.4 JP12.4 92.23,44.04 91.88,44.39 JP9.2 91.88,48.71 90.58,50.01 87.53,50.01 84.87,52.67 84.87,72.48 IC10.2
B_OUT_DET_3  (via drill 0.35)
  Top 0.254: JP7.3 JP12.3 89.69,44.04 89.08,44.65 JP10.2 89.08,47.24 v89.69,47.85 | v79.02,69.94 IC10.4
  Bottom 0.254: v89.69,47.85 87.91,49.62 85.69,49.62 80.45,54.87 80.45,57.41 80.04,57.82 80.04,69.94 v79.02,69.94
B_OUT_DET_4  (via drill 0.35)
  Top 0.254: JP7.2 JP12.2 87.15,43.78 86.29,44.65 JP11.2 86.9,46.93 v86.9,47.85 | v79.02,68.67 IC10.5
  Bottom 0.254: v86.9,47.85 83.34,51.4 80.04,54.7 80.04,57.24 79.02,58.26 v79.02,68.67
D_OUT_L1  (via drill 0.35)
  Top 0.254: IC4.3 38.94,33.83 38.64,34.13 | 38.64,34.13 37.37,35.4 37.37,37.92 37.45,38 D1.A | v37.37,33.11 38.38,34.13 38.64,34.13 | IC9.1 66.32,73.75 v66.07,74.01
  Bottom 0.254: R41.1 45.32,27.7 40.92,32.1 38.38,32.1 v37.37,33.11 41.43,37.18 46.26,37.18 47.53,38.45 45.24,40.73 38.38,40.73 38.38,46.07 38.89,46.58 40.42,46.58 41.18,47.34 41.18,57.24 42.96,59.02 67.85,59.02 67.85,68.67 65.05,71.47 65.05,72.99 v66.07,74.01
D_OUT_L2  (via drill 0.35)
  Top 0.254: IC5.3 74.87,45.21 74.71,45.05 | 74.71,45.05 74.58,44.92 D2.A 73.59,40.64 v73.44,40.48 | IC9.2 v66.32,72.48 | v76.23,44.29 75.47,44.29 74.71,45.05
  Bottom 0.254: R42.1 63.74,35.36 64.8,36.42 64.8,39.46 72.42,39.46 v73.44,40.48 | v66.32,72.48 66.32,71.72 73.94,64.1 73.94,46.58 v76.23,44.29
D_OUT_L3  (via drill 0.35)
  Top 0.254: D3.A 25.18,48.61 26.45,48.61 26.82,48.98 IC6.3 26.82,53.31 26.7,53.43 25.18,53.43 v22.13,56.48 | IC9.4 64.8,69.94 64.7,70.05 64.7,73.16 59.89,77.97 52.69,77.97 50,75.28 v46.26,75.28
  Bottom 0.254: v22.13,56.48 22.13,60.29 30.51,68.67 30.51,81.37 31.02,81.88 39.15,81.88 44.24,76.78 R43.1 44.27,75.28 v46.26,75.28
D_OUT_L4  (via drill 0.35)
  Top 0.254: D4.A 47.85,66.58 50.58,63.85 50.58,62.32 53.12,62.32 53.7,62.91 IC7.3 53.7,65.7 54.13,66.13 55.66,66.13 v55.66,63.09 | IC9.5 v66.32,68.67
  Bottom 0.254: R44.1 23.02,62.71 20.86,60.55 20.86,55.97 21.87,54.96 23.65,54.96 29.75,61.05 29.75,64.36 30.51,65.12 37.11,65.12 43.46,71.47 49.81,71.47 55.66,65.63 | 55.66,65.63 v55.66,63.09 | v66.32,68.67 63.28,65.63 55.66,65.63
GND  (via drill 0.35)
  Top 0.254: v59.97,36.16 60.99,37.18 v60.99,37.69 | v15.78,67.66 18.83,64.61 v18.83,64.36
  Bottom 0.203: C27.2 23.65,25.55
  Bottom 0.254: IC8.11 30.38,19.27 v29.75,19.91 | U1.2 31.99,27.32 v31.27,28.03 | 23.65,25.55 v23.65,23.72 | C1.2 43.72,43.27 43.21,43.78 v42.45,43.78 | C9.- arc-90 57.06,36.16 v59.97,36.16 | v52.35,29.05 52.44,29.05 53.4,30 R41.3 | R46.3 71.78,37.43 v70.13,37.43 | R42.3 62.56,37.69 v60.99,37.69 | C2.2 v63.53,42.01 v63.53,42 | C10.- 68.6,42.75 v67.34,41.5 | v52.35,60.29 52.35,61.13 51.31,62.17 C12.- | C4.2 39.38,65.61 v39.91,66.13 | C11.- 32.53,49.64 v33.05,49.12 | R47.3 38.54,77.31 v40.16,77.31 | R48.3 15.72,67.71 v15.78,67.66 | R44.3 18.89,64.42 v18.83,64.36 | R43.3 46.04,72.95 v46.26,72.74 | R34.1 39.71,22.9 39.65,22.95 40.42,23.72 v41.18,23.72 | R36.1 44.73,19.04 44.73,20.41 45.75,21.43 45.75,23.67 v45.73,23.69 | R38.1 52.08,15.57 52.1,15.59 52.1,17.11 | 52.1,17.11 v52.1,22.19 | R40.1 56.68,17.1 56.67,17.11 52.1,17.11 | R45.3 62.56,28.08 v59.72,25.24
  Bottom 0.406: C26.- 15.86,23.8 v16.54,24.48 | C24.2 27.85,13.56 29.75,13.56 v31.78,15.59 | C25.- 68.04,10.19 67.09,9.24 v66.83,9.24
  pour Top: 46.43,0.13 50,0 53.57,0.13 57.12,0.51 60.63,1.14 64.09,2.03 67.47,3.15 70.77,4.52 73.96,6.12 77.03,7.94 79.96,9.97 82.74,12.21 85.36,14.64 87.79,17.26 90.03,20.04 92.06,22.97 93.88,26.04 95.48,29.23 96.85,32.53 97.97,35.91 98.86,39.37 99.49,42.88 99.87,46.43 100,50 99.87,53.57 99.49,57.12 98.86,60.63 97.97,64.09 96.85,67.47 95.48,70.77 93.88,73.96 92.06,77.03 90.03,79.96 87.79,82.74 85.36,85.36 82.74,87.79 79.96,90.03 77.03,92.06 73.96,93.88 70.77,95.48 67.47,96.85 64.09,97.97 60.63,98.86 57.12,99.49 53.57,99.87 50,100 46.43,99.87 42.88,99.49 39.37,98.86 35.91,97.97 32.53,96.85 29.23,95.48 26.04,93.88 22.97,92.06 20.04,90.03 17.26,87.79 14.64,85.36 12.21,82.74 9.97,79.96 7.94,77.03 6.12,73.96 4.52,70.77 3.15,67.47 2.03,64.09 1.14,60.63 0.51,57.12 0.13,53.57 0,50 0.13,46.43 0.51,42.88 1.14,39.37 2.03,35.91 3.15,32.53 4.52,29.23 6.12,26.04 7.94,22.97 9.97,20.04 12.21,17.26 14.64,14.64 17.26,12.21 20.04,9.97 22.97,7.94 26.04,6.12 29.23,4.52 32.53,3.15 35.91,2.03 39.37,1.14 42.88,0.51
N$1
  Top 0.254: 53.43,42.36 Q5.3
  Top 0.406: -.1 53.43,42.36
N$2
  Top 0.254: +.1 48.44,42.37 | R9.1 46.77,43.36 46.77,41.81 R21.2
  Top 0.406: 46.77,43.36 47.45,43.36 48.44,42.37
N$3
  Top 0.254: Q5.1 55.66,39.59 Q1.3 | TP6.TP 54.67,39.56 Q1.3 | R5.1 58.05,39.56 Q1.3
N$4
  Top 0.254: Q1.1 54.06,37.36 53.78,37.08 R1.1
N$5  (via drill 0.35)
  Top 0.254: R1.2 52.35,39.36 52.35,39.97 52.23,40.09 TP5.TP 51.18,39.97 v49.81,39.97 | IC1.1 66.69,34.47 R17.2 66.38,36.86 63.28,39.97 v62.51,39.97
  Bottom 0.254: v49.81,39.97 v62.51,39.97
N$6
  Top 0.254: IC1.2 64.41,31.47 64.12,31.76 R33.2 64.12,33.2 64.68,33.76 R17.1
N$7
  Top 0.254: IC1.3 64.06,30.2 R29.2 63.92,28.02 R25.2
N$8  (via drill 0.35)
  Top 0.254: TP1.TP 44.87,40.87 44.36,40.36 Q9.3 44.45,39.81 R21.1 46.47,38.41 46,37.94 v45.24,37.94 | IC3.4 22.11,37.7 v20.86,38.96
  Bottom 0.254: v45.24,37.94 44.48,37.94 44.23,38.19 44.23,38.92 C1.1 43.18,39.97 21.87,39.97 v20.86,38.96
N$9
  Top 0.254: Q9.1 42.16,42.36 R13.2
N$10
  Top 0.508: L1.1 48.29,11.74 | 48.29,11.74 47.15,11.74 C21.1 | J1.VBUS 48.25,11.71 48.29,11.74
N$11
  Top 0.254: R49.1 41.95,35.41 41.43,34.89 | 41.43,34.89 41.02,34.48 IC4.2 39.05,34.48 38.62,34.91 TP3.TP | 41.43,34.89 42.96,33.37 42.96,32.1 37.11,32.1 35.34,33.88 35.34,36.16 35.08,36.42 31.02,36.42 28.48,38.96 24.67,38.96 24.67,36.43 IC3.2
N$12
  Top 0.254: Q17.B 54.31,32.09 Q13.C 54.92,32.1 55.91,32.1 55.91,32.86 55.91,32.94 | 55.91,32.94 55.91,33.64 Q13.B | R53.2 55.91,32.94
N$13  (via drill 0.35)
  Top 0.254: v60.74,30.07 v60.74,30.06 R29.1
  Bottom 0.254: R41.2 60.29,28.85 60.74,29.3 v60.74,30.07
N$14  (via drill 0.35)
  Top 0.254: v59.97,32.35 62.38,32.35 R33.1
  Bottom 0.254: R45.2 60.39,31.93 v59.97,32.35
N$15  (via drill 0.35)
  Top 0.254: IC9.3 70.39,71.21 v70.64,70.96 | v72.17,67.4 IC9.9
  Bottom 0.254: v70.64,70.96 72.17,69.44 v72.17,67.4
N$16  (via drill 0.35)
  Top 0.254: v63.53,26.26 63.66,26.39 65.05,26.39 | 65.05,26.39 IC1.6 | IC1.7 66.57,25.24 65.05,25.24 65.05,26.39
  Bottom 0.254: R45.1 68.51,26.41 68.1,26 63.78,26 v63.53,26.26
N$17  (via drill 0.35)
  Top 0.254: 48.69,33.83 Q17.C 48.69,31.7 49.81,30.57 56.67,30.57 63.28,23.97 68.86,23.97 68.86,27.53 68.73,27.66 IC1.5 | 48.69,33.83 48.69,35.8 v48.8,35.91 48.04,36.67 TP2.TP | IC4.6 47.53,33.83 | 47.53,33.83 48.69,33.83 | IC4.7 47.53,34.48 47.53,33.83
  Bottom 0.254: v48.8,35.91 51.41,35.91 C9.+
N$18
  Top 0.254: R13.1 40.42,41.5 40.32,41.4 D1.C 37.55,41.24 35.34,41.24 35.15,41.06 R57.2 33.03,39.97 C13.1 31.41,39.61 30.47,38.67 TP7.TP
N$19
  Top 0.254: C17.1 45.85,33.07 IC4.5
N$20  (via drill 0.35)
  Top 0.254: IC3.5 20.86,36.4 20.86,34.38 29.49,34.38 35.84,28.03 v35.84,23.72 v35.84,23.71 TP4.TP 33.84,20.67 C5.1
  Bottom 0.254: v35.84,23.72 35.84,24.73 36.55,25.43 R34.2
N$21
  Top 0.406: Q6.3 56.96,52.9 57.59,52.26 -2.1
N$22
  Top 0.254: R22.2 60.62,48.96 +2.1
  Top 0.406: R10.1 57.12,48.48 +2.1
N$23
  Top 0.254: Q6.1 59.27,53.13 Q2.3 | Q2.3 62.28,50.95 TP13.TP | R6.1 63.59,52.35 62.82,53.13 Q2.3
N$24
  Top 0.254: Q2.1 63.67,54.89 R2.1
N$25  (via drill 0.35)
  Top 0.254: IC1.8 74.08,25.12 v74.2,25.24 75.72,26.76 79.02,26.76 79.02,30.83 76.89,32.96 76.89,42.09 81.97,47.17 81.97,54.86 83.85,56.74 83.85,60.55 82.58,61.82 71.15,61.82 67.85,58.51 67.85,54.98 | R2.2 66.91,54.98 67.85,54.98 | 67.85,54.98 TP12.TP
  Bottom 0.254: v74.2,25.24 74.71,25.24 75.72,26.26 75.72,29.56 75.56,29.72 R18.2
N$26  (via drill 0.35)
  Top 0.254: IC1.9 74.08,26.39 v74.2,26.51
  Bottom 0.254: v74.2,26.51 74.2,26.76 73.88,27.08 R18.1 71.54,28.02 R35.2
N$27
  Top 0.254: IC1.10 72.01,27.78 R30.2 75.69,27.8 R26.2
N$28  (via drill 0.35)
  Top 0.254: TP8.TP 62.12,47.34 60.74,47.34 R22.1 60.64,46.16 61.02,45.78 Q10.3 61.02,42.03 v60.99,42 60.99,40.99 65.05,40.99 69.63,36.42 69.63,24.16 69.03,23.56 57.08,23.56 v55.15,25.49 | IC3.6 19.57,38.46 v19.08,38.96
  Bottom 0.254: C2.1 60.73,42.52 60.74,42.51 60.74,42.26 v60.99,42 | v19.08,38.96 21.62,36.42 31.02,36.42 36.1,31.34 40.67,31.34 46.51,25.49 v55.15,25.49
N$29
  Top 0.254: Q10.1 64.1,43.97 64.29,43.78 65.22,43.78 R14.2
N$30  (via drill 0.35)
  Top 0.254: IC5.2 74.22,49.39 74.71,49.88 77.75,49.88 78.28,49.35 | 78.28,49.35 R50.1 78.36,48.12 TP10.TP | IC3.1 25.94,36.43 25.94,38.55 27.11,38.55 v30.51,35.15 | v79.28,49.62 79.01,49.35 78.28,49.35
  Bottom 0.254: v30.51,35.15 31.53,34.13 32.73,34.13 35.93,30.93 40.5,30.93 47.72,23.72 57.43,23.72 62.77,18.38 64.55,18.38 68.1,21.94 70.24,24.07 75.13,24.07 77.65,26.6 77.65,31.34 79.28,32.96 v79.28,49.62
N$31
  Top 0.254: Q18.B 76.74,59.9 76.99,59.9 | 76.99,59.9 77.79,59.9 Q14.C 77.92,59.77 R54.2 | Q14.B 76.91,59.82 76.99,59.9
N$32  (via drill 0.35)
  Top 0.254: R30.1 75.72,29.54 75.72,30.83 75.98,31.08 v76.23,31.08
  Bottom 0.254: v76.23,31.08 75.72,31.59 71.66,31.59 69.37,33.88 66.58,33.88 66.44,34.01 R42.2
N$33
  Bottom 0.254: R35.1 71.38,29.56 70.39,29.56 70.13,29.3 70.13,24.48 74.96,24.48 77.25,26.76 77.25,32.35 75.72,33.88 R46.2
N$34
  Top 0.254: IC9.6 70.64,67.4 71.91,68.67 IC9.10
N$35  (via drill 0.35)
  Top 0.254: IC1.14 73.69,32.74 | 73.69,32.74 74.08,32.74 v74.2,32.86 | IC1.13 73.31,31.47 73.69,31.84 73.69,32.74
  Bottom 0.254: v74.2,32.86 74.2,34.38 73.55,35.03 R46.1
N$36  (via drill 0.35)
  Top 0.254: Q18.C 74.22,57.45 74.22,55.97 | 74.22,55.97 IC5.7 | IC5.6 IC5.7 | TP9.TP 75.97,55.97 74.22,55.97 | v71.15,51.66 71.66,51.66 72.67,52.67 74.2,52.67 | 74.2,52.67 74.22,52.69 IC5.7 | IC1.12 73.82,30.2 76.48,32.86 76.48,42.26 81.56,47.34 81.56,51.15 75.72,51.15 74.2,52.67
  Bottom 0.254: C10.+ v71.15,51.66
N$37
  Top 0.254: C18.1 77.92,54.03 IC5.5
N$38
  Top 0.254: TP14.TP 65.45,45.71 R14.1 65.37,45.54 R58.2 68.13,45.54 68.86,44.8 70.07,44.8 D2.C 70.07,44.8 C14.1
N$39  (via drill 0.35)
  Top 0.254: TP11.TP 43.21,18.99 C6.1 43.06,20.51 43.46,20.92 v43.46,21.18 38.64,21.18 36.61,19.14 32.54,19.14 32.03,19.65 32.03,25.24 35.05,28.25 29.33,33.98 18.72,33.98 18.3,34.4 IC3.7
  Bottom 0.254: v43.46,21.18 43.46,22.77 R36.2
N$40
  Top 0.406: Q7.3 43.09,52.8 42.45,52.16 -3.1
N$41
  Top 0.254: +3.1 39.68,49.03 R23.2
  Top 0.406: R11.1 42.54,48.93 +3.1
N$42
  Top 0.254: Q7.1 39.15,55.08 | 39.15,55.08 37.5,55.08 Q3.3 34.41,55.17 R7.1 | TP20.TP 39.15,56.71 39.15,55.08
N$43
  Top 0.254: Q3.1 33.99,52.97 R3.1
N$44  (via drill 0.35)
  Top 0.254: R3.2 35.08,51.35 | 35.08,51.35 35.78,51.35 TP19.TP | IC2.1 33.96,68.65 R19.2 34.16,66.04 35.08,65.12 37.37,65.12 v37.37,63.34 | v35.08,49.88 35.08,51.35
  Bottom 0.254: v37.37,63.34 37.37,54.2 35.08,51.91 v35.08,49.88
N$45
  Top 0.254: IC2.2 33.93,69.92 R19.1 36.46,70.14 R37.2
N$46
  Top 0.254: IC2.3 33.28,71.19 34,71.91 R31.2 36.68,71.91 37.11,71.47 38.93,71.47 R27.2
N$47
  Top 0.254: R23.1 39.65,46.58 39.21,46.13 37.62,46.13 | 37.62,46.13 Q11.3 | TP15.TP 37.85,44.04 | 37.85,44.04 37.85,45.9 37.62,46.13 | IC3.8 18.32,31.23 18.32,32.86 17.05,34.13 17.05,40.23 28.48,40.23 | 28.48,40.23 29.75,40.23 31.02,41.5 33.81,41.5 35.34,43.02 37.88,43.02 37.88,44.01 37.85,44.04 | C3.1 28.42,40.29 28.48,40.23
N$48
  Top 0.254: Q11.1 33.16,47.08 R15.2
N$49
  Top 0.254: IC6.2 26.17,52.44 25.68,52.93 22.52,52.93 21.54,51.95 R51.1 21.4,51.59 TP17.TP 19.39,48.92 16.13,45.66 16.13,29.46 18.06,27.53 24.92,27.53 25.92,28.53 IC3.14
N$50
  Top 0.254: R55.2 34.88,63.85 33.02,63.85 Q15.B 32.81,62.34 32.8,62.32 32.32,62.32 Q15.C 31.81,61.82 30.51,61.82 29.53,62.79 Q19.B
N$51  (via drill 0.35)
  Top 0.254: v38.13,74.01 37.11,74.01 36.71,73.61 R31.1
  Bottom 0.254: R43.2 40.3,74.01 v38.13,74.01
N$52  (via drill 0.35)
  Top 0.254: v35.84,66.64 36.51,67.31 R37.1
  Bottom 0.254: R47.2 34.66,67.83 v35.84,66.64
N$53
  Top 0.254: JP11.1 85.48,48.2 86.14,48.86 | 86.14,48.86 87.66,48.86 88.27,48.25 JP10.1 88.27,48.2 88.93,48.86 90.2,48.86 91.06,48 JP9.1 | 86.14,48.86 84.36,50.64 84.36,60.8 82.83,62.32 76.23,62.32 76.08,62.48 JP8.1 74.96,64.1 74.48,64.59 IC9.8
N$54  (via drill 0.35)
  Top 0.254: IC2.6 33.02,75 33.69,75.66 33.08,76.27 32.82,76.27 | v32.8,78.33 32.8,76.29 32.82,76.27 | 32.82,76.27 IC2.7
  Bottom 0.254: R47.1 38.51,80.49 37.62,81.37 34.07,81.37 32.8,80.1 v32.8,78.33
N$55  (via drill 0.35)
  Top 0.254: TP16.TP 29.06,60.55 27.71,60.55 Q19.C 26.17,59.09 IC6.7 IC6.6 26.82,56.11 26.95,55.98 | 26.95,55.98 v28.48,54.45 | IC2.5 29.72,73.73 29.49,73.5 29.49,65.37 28.63,64.51 26.79,64.51 23.65,61.38 23.65,55.97 26.94,55.97 26.95,55.98
  Bottom 0.254: v28.48,54.45 28.48,53.56 27.13,52.21 C11.+
N$56
  Top 0.254: C19.1 30.19,57.34 IC6.5
N$57
  Top 0.254: TP21.TP 32.99,44.97 R15.1 30.18,45.09 R59.2 27.7,45.01 C15.1 24.84,44.87 D3.C
N$58  (via drill 0.35)
  Top 0.254: TP18.TP 50.95,18.9 C7.1 50.86,20.89 50.32,21.43 v49.31,21.43 48.54,22.19 37.62,22.19 37.37,22.45 37.37,27.27 v37.11,27.53 | v33.05,28.8 33.05,29.68 29.16,33.57 19.59,33.57 19.59,31.23 IC3.9
  Bottom 0.254: v49.31,21.43 49.28,21.41 R38.2 | v37.11,27.53 35.08,27.53 34.07,28.54 33.3,28.54 v33.05,28.8
N$59
  Top 0.406: -4.1 51.87,57.91 Q8.3
N$60
  Top 0.254: R24.2 46.63,59.51 R12.1
  Top 0.406: R12.1 +4.1
N$61
  Top 0.254: Q8.1 57.99,56.96 Q4.3 59.43,59.33 58.59,60.17 | R8.1 58.59,60.17 | TP27.TP 58.63,60.17 58.59,60.17
N$62
  Top 0.254: R4.1 61.65,57.48 Q4.1
N$63
  Top 0.254: R4.2 64.55,59.18 | 64.55,59.18 66.22,59.18 TP26.TP | R20.2 23.58,77.38 24.7,76.27 IC2.8 26.18,77.3 26.7,77.82 27.56,77.82 27.56,78.24 29.07,79.75 35.5,79.75 41.25,74.01 49.31,74.01 52.86,77.56 59.72,77.56 64.29,72.99 64.29,59.43 64.55,59.18
N$64
  Top 0.254: R39.2 22.82,75.54 R20.1 24.01,75.68 24.7,75 IC2.9
N$65
  Top 0.254: IC2.10 23.62,73.73 R32.2 23.57,71.5 R28.2
N$66  (via drill 0.35)
  Top 0.254: Q12.3 44.22,60.55 44.23,60.55 44.48,60.55 | 44.48,60.55 45.24,60.55 45.94,61.24 R24.1 48.95,61.24 TP22.TP | v44.48,62.07 44.48,60.55 | IC3.10 20.84,29.29 20.6,29.05 17.3,29.05 16.54,29.81 16.54,40.73 v17.81,42
  Bottom 0.254: v44.48,62.07 43.62,61.21 C4.1 39.38,48.34 38.89,47.85 23.65,47.85 v17.81,42
N$67
  Top 0.254: Q12.1 41.88,61.56 R16.2
N$68  (via drill 0.35)
  Top 0.254: TP24.TP 57.84,63.19 56.98,64.04 R52.1 56.98,66.08 56.42,66.64 56.16,66.64 | IC7.2 53.05,65.81 53.88,66.64 56.16,66.64 | IC3.13 24.65,29.29 v23.91,28.54 | v56.16,68.17 56.16,66.64
  Bottom 0.254: v23.91,28.54 16.54,35.91 16.54,63.85 19.08,66.39 27.65,66.39 30.1,68.84 30.1,81.54 30.85,82.29 42.04,82.29 v56.16,68.17
N$69
  Top 0.254: Q20.B 56.12,73.72 Q16.C 57.7,73.75 58.45,73.75 58.62,73.92 58.62,74.26 | 58.62,74.26 Q16.B | R56.2 60.5,74.26 58.62,74.26
N$70  (via drill 0.35)
  Top 0.254: v19.84,71.72 19.84,72.99 20.53,73.68 R32.1
  Bottom 0.254: v19.84,71.72 19.84,71.31 21.87,69.28 R44.2
N$71  (via drill 0.35)
  Top 0.254: v17.3,75.79 18.75,77.24 R39.1
  Bottom 0.254: R48.2 17.3,73.93 v17.3,75.79
N$72  (via drill 0.35)
  Top 0.254: IC10.9 v85.63,67.4 | v83.85,69.44 83.85,70.45 83.09,71.21 IC10.3
  Bottom 0.254: v85.63,67.4 83.85,69.18 v83.85,69.44
N$73  (via drill 0.35)
  Top 0.254: v18.06,67.4 18.06,68.42 19.59,69.94 24.16,69.94 | 24.16,69.94 26.16,69.94 IC2.13 | IC2.14 24.44,68.65 24.16,68.93 24.16,69.94
  Bottom 0.254: R48.1 18.02,67.45 v18.06,67.4
N$74  (via drill 0.35)
  Top 0.254: 53.7,72.93 IC7.6 IC7.7 53.05,69.12 52.61,68.67 50.58,68.67 49.56,69.69 v49.56,70.45 44.23,70.45 35.34,79.34 29.24,79.34 27.97,78.07 27.97,71.47 27.69,71.19 IC2.12 | 53.7,72.93 Q20.C | TP23.TP 55.65,71.99 54.64,72.99 53.77,72.99 53.7,72.93
  Bottom 0.254: C12.+ 50.3,69.72 v49.56,70.45
N$75
  Top 0.254: IC7.5 54.44,70.2 55.66,70.2 55.93,69.93 C20.1
N$76
  Top 0.254: C16.1 45.58,63.59 R16.1 43.72,63.73 43.72,64.61 44.34,65.23 R60.2 | R60.2 41.99,65.96 TP28.TP | R60.2 44.34,68.42 D4.C
N$77  (via drill 0.35)
  Top 0.254: TP25.TP 55.56,18.87 C8.1 57.5,20.6 57.18,20.92 v55.66,20.92 52.1,20.92 50.32,22.7 37.88,22.7 37.88,28.03 37.11,28.8 v36.61,28.8 | v31.27,29.81 31.27,30.83 28.99,33.11 22.13,33.11 22.13,31.23 IC3.11
  Bottom 0.254: R40.2 55.53,20.8 v55.66,20.92 | v36.61,28.8 35.59,29.81 v31.27,29.81
N$78
  Bottom 0.203: 29.11,25.42 R62.1 29.24,25.55 | 26.54,25.46 C27.1
  Bottom 0.254: IC8.3 29.11,25.42 | R62.1 26.54,25.46 | U1.1 31.5,26.76 29.24,26.76 29.24,25.55
N$79
  Top 0.61: L2.1 71.66,17.82 70.64,17.82 | 70.64,17.82 63.48,17.82 60.48,14.83 JP3.2 | C28.+ 70.64,14.59 70.64,17.82
  Top 0.813: JP4.2 68.45,14.53 C28.+ 71.15,14.24 71.66,14.24 75.69,14.24 arc90 C30.1
N$80
  Top 0.508: 50.83,14.31 C22.1
  Top 0.61: JP5.1 44.48,14.32 46.51,16.35 50.07,16.35 50.58,15.84 50.58,14.57 50.83,14.31 | C22.1 53.37,14.31 53.88,14.83 54.64,14.83 | 54.64,14.83 JP3.1 | L1.2 54.64,11.83 54.64,14.83
N$81
  Top 0.254: J1.D- 49.05,11.02 49.85,11.02 J1.D+
N$82
  Top 0.61: JP4.1 63.33,15.65 63.18,15.49 U2.2 U2.4
N$83
  Top 0.61: U3.2 26.22,13.56 | 26.22,13.56 26.22,10.51 U3.4 | JP6.1 35.34,15.06 35.34,14.57 34.32,13.56 27.97,13.56 26.22,13.56
N$84
  Bottom 0.813: X1.1 36.49,9.17 D5.A
N$85
  Bottom 1.016: D5.C 41.45,11.97 41.45,14.64 FUSE.1
N$86  (via drill 0.35)
  Top 0.254: IC10.6 v78.01,67.4 | v90.2,68.67 IC10.10
  Bottom 0.254: v78.01,67.4 78.01,70.45 78.52,70.96 87.91,70.96 v90.2,68.67
N$87
  Top 0.254: IC12.11 66.07,88.74 65.82,88.99 65.05,88.99 64.8,88.74 IC12.12
N$88  (via drill 0.35)
  Top 0.254: IC12.13 v63.53,84.93 | v90.2,66.13 IC10.8 | IC11.1 v39.4,84.42
  Bottom 0.254: v90.2,66.13 91.22,67.15 91.22,69.18 88.93,71.47 76.99,71.47 63.66,84.8 v63.53,84.93 62.26,84.93 60.23,82.9 48.54,82.9 47.02,84.42 v39.4,84.42
N$89  (via drill 0.35)
  Top 0.254: IC12.10 67.34,84.68 66.58,83.91 v50.83,83.91 | v41.94,85.95 IC11.12
  Bottom 0.254: v50.83,83.91 48.54,83.91 46.51,85.95 v41.94,85.95
N$90
  Top 0.254: 32.93,87.72 32.93,88.36 34.68,90.11 S1.2 37.37,90.77 38.38,91.79 40.67,91.79 IC11.13 | 32.93,87.72 C32.1 | R63.1 32.38,85.78 33.05,86.45 33.05,87.6 32.93,87.72
N$91
  Top 0.254: R64.2 88.78,61.5 Q21.1 91.47,61.83 91.47,69.69 91.22,69.94 IC10.11
N$92
  Top 0.813: X2.1 5.11,57.58 Q22.3
N$93
  Top 0.254: IC12.9 68.61,88.74 68.27,89.08 R65.2 66.45,90.26 C33.1
N$94
  Top 0.254: IC10.12 85.37,71.21 85.37,73.65 82.99,76.04 JP13.2 81.97,77.92 72.65,87.24 IC12.8 69.88,88.99 | 69.88,88.99 69.88,90.18 R65.1 | TP29.TP 69.88,88.99
N$95  (via drill 0.35)
  Top 0.254: v93.25,58.26 93.33,58.34 Q21.3 93.25,60.63 v93.25,62.83
  Bottom 0.254: 81.31,28.51 80.14,28.51 75.3,23.66 70.4,23.66 64.71,17.98 62.6,17.98 57.27,23.31 47.55,23.31 40.33,30.52 35.13,30.52 34.32,31.34 30.76,31.34 26.95,27.53 18.03,27.53 17.81,27.75 LED2.C | 81.31,28.51 LED1.C | v93.25,58.26 93.25,47.85 90.45,45.05 82.33,45.05 81.31,44.04 81.31,28.51 | v93.25,62.83 91.62,64.46 91.62,69.35 89,71.98 79.79,71.98 64.8,86.96 55.15,86.96 52.1,90.01 LED3.C
N$96
  Bottom 0.254: R66.2 85.12,33.37 83.6,31.84 LED1.A
N$97
  Bottom 0.254: LED2.A 17.81,32.61 16.12,34.3 R67.2
N$98
  Bottom 0.254: LED3.A 47.24,91.53 R68.2
N$100
  Top 0.254: IC10.13 89.69,72.48 89.69,75.28 87.41,77.56 84.1,77.56 73.44,88.23 73.44,90.01 70.9,92.55 55.91,92.55 47.78,84.42 41.94,84.42 IC11.3 41.94,80.36 20.1,80.36 14,74.26 14,63.85 13.49,63.34 R71.2
N$101
  Top 0.254: Q22.1 10.04,56.8 R70.1 10.1,59.03 Q23.3
N$102
  Top 0.254: Q23.1 10.89,63.32 R71.1
V+  (via drill 0.35)
  Top 0.305: 42.58,45.56 R11.2 42.51,45.56 | 58.45,44.08 v58.45,44.04
  Top 0.406: 42.58,45.56 44.23,45.56 44.97,44.82 R9.2 | R10.2 58.45,44.08 | v40.67,45.56 42.51,45.56 | 62.91,18.58 63.02,18.7 v63.02,19.4 v63.02,20.41 | R12.2 43.29,57.58 v43.21,57.5
  Top 0.61: JP5.2 37.88,16.86 37.88,17.11 | 37.88,17.11 37.88,18.13 35.34,18.13 | JP2.3 82.69,23.32 81.34,21.97 JP1.3 79.95,21.94 73.44,21.94 70.08,18.58 62.91,18.58 61.44,17.11 37.88,17.11 | 35.34,18.13 35.28,18.07 JP6.2 | 35.34,18.13 30.26,18.13 25.83,22.55 C29.+ 18.68,22.85 C31.1
  Bottom 0.406: v58.45,44.04 54.13,44.04 52.86,42.77 48.54,42.77 | 48.54,42.77 46.77,42.77 43.97,45.56 43.21,45.56 | 43.21,45.56 v40.67,45.56 | 48.54,42.77 48.54,38.45 46.77,36.67 46.77,33.11 56.42,33.11 56.93,32.61 56.93,26.51 v63.02,20.41 v63.02,19.4 | v43.21,57.5 43.21,45.56

### Text on the board
tNames: BYTECHLAB.COM | NC | BRD NUM | - | BRD4 | BRD3 | BRD2 | + | B.O.L.T | OD OUT | + | -
bNames: M3 | LED3_ADJ | LED4_ADJ | REV: 1.0 | BYTECHLAB R&D | LED2_ADJ | M3 | M3 | 1 | ADJ | 2 | 3 | LED1_ADJ | 4